# EasyEDA Pro project ProPrj_电池电量显示与开关_2025-10-14.epro

# Schematic Schematic1

## Sheets
1 P1: Board Name: Board1; Create Date: 2025-09-26; Page Name: P1; Project Name: 电池电量显示与开关; Schematic Name: Schematic1; Update Date: 2025-10-06; Company: 嘉立创EDA; Page Size: A4; Version: V1.0
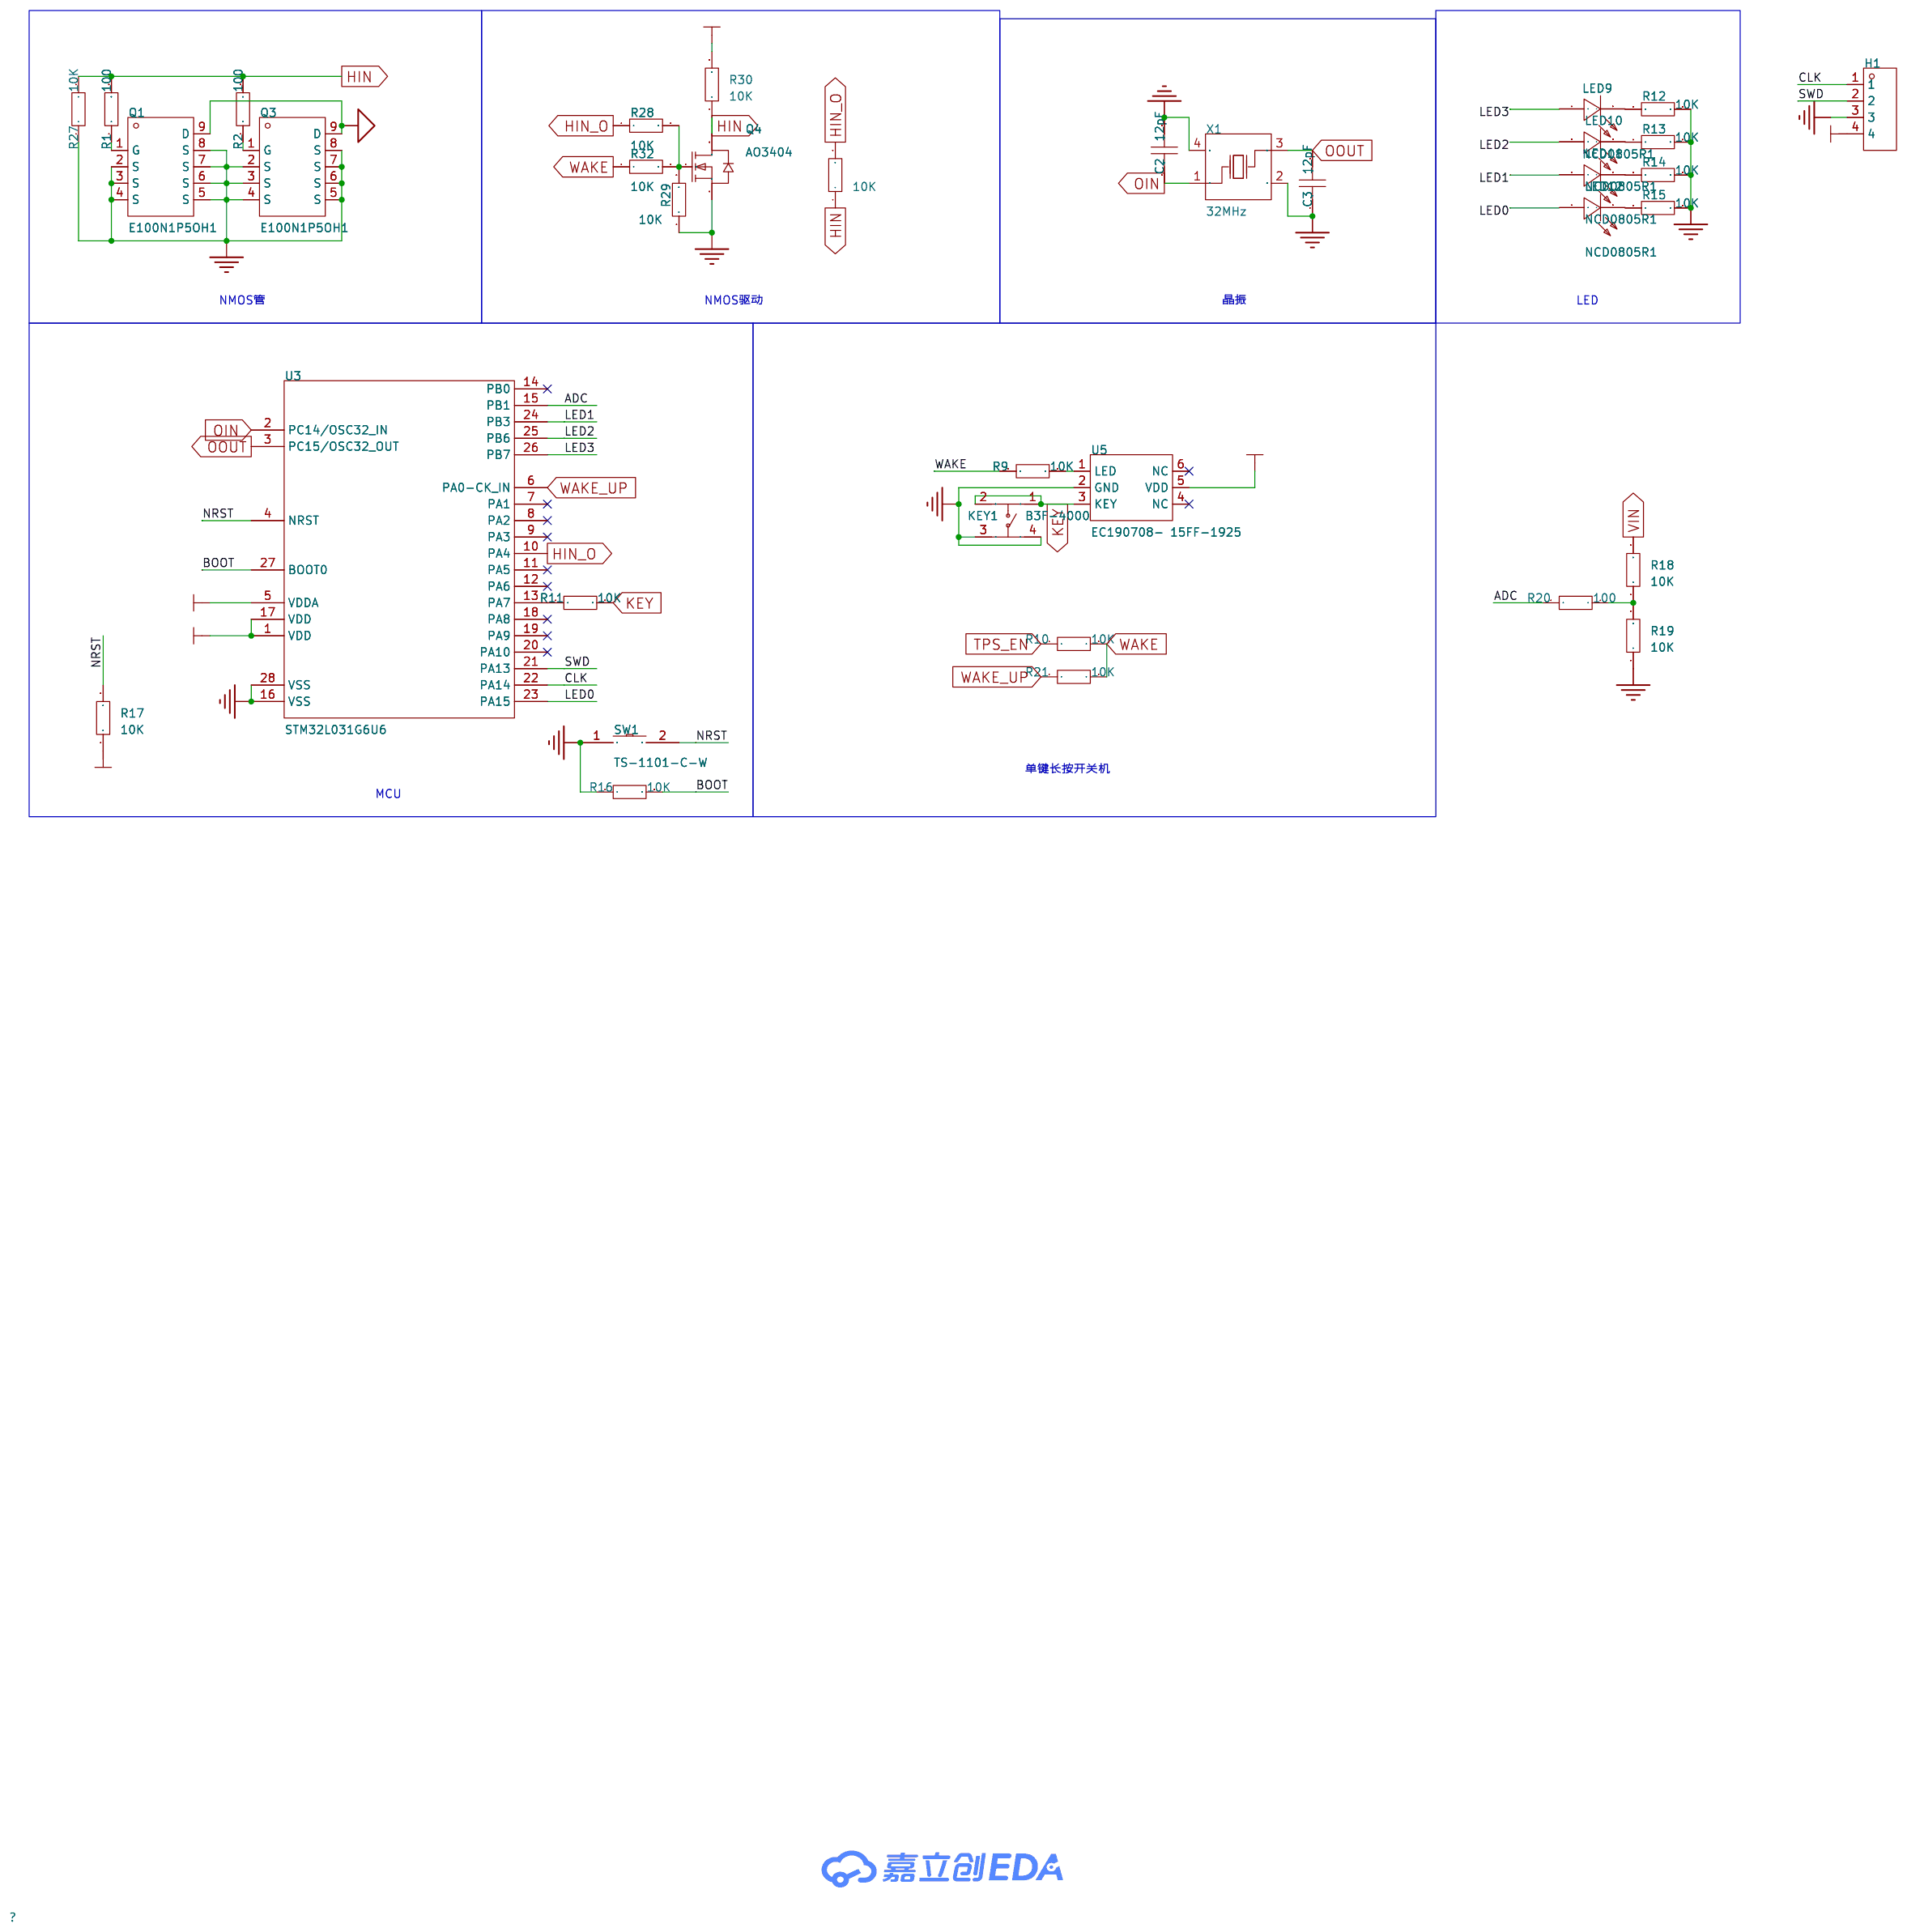
[diagram p0: P1]
2 PWOER: Page Name: PWOER
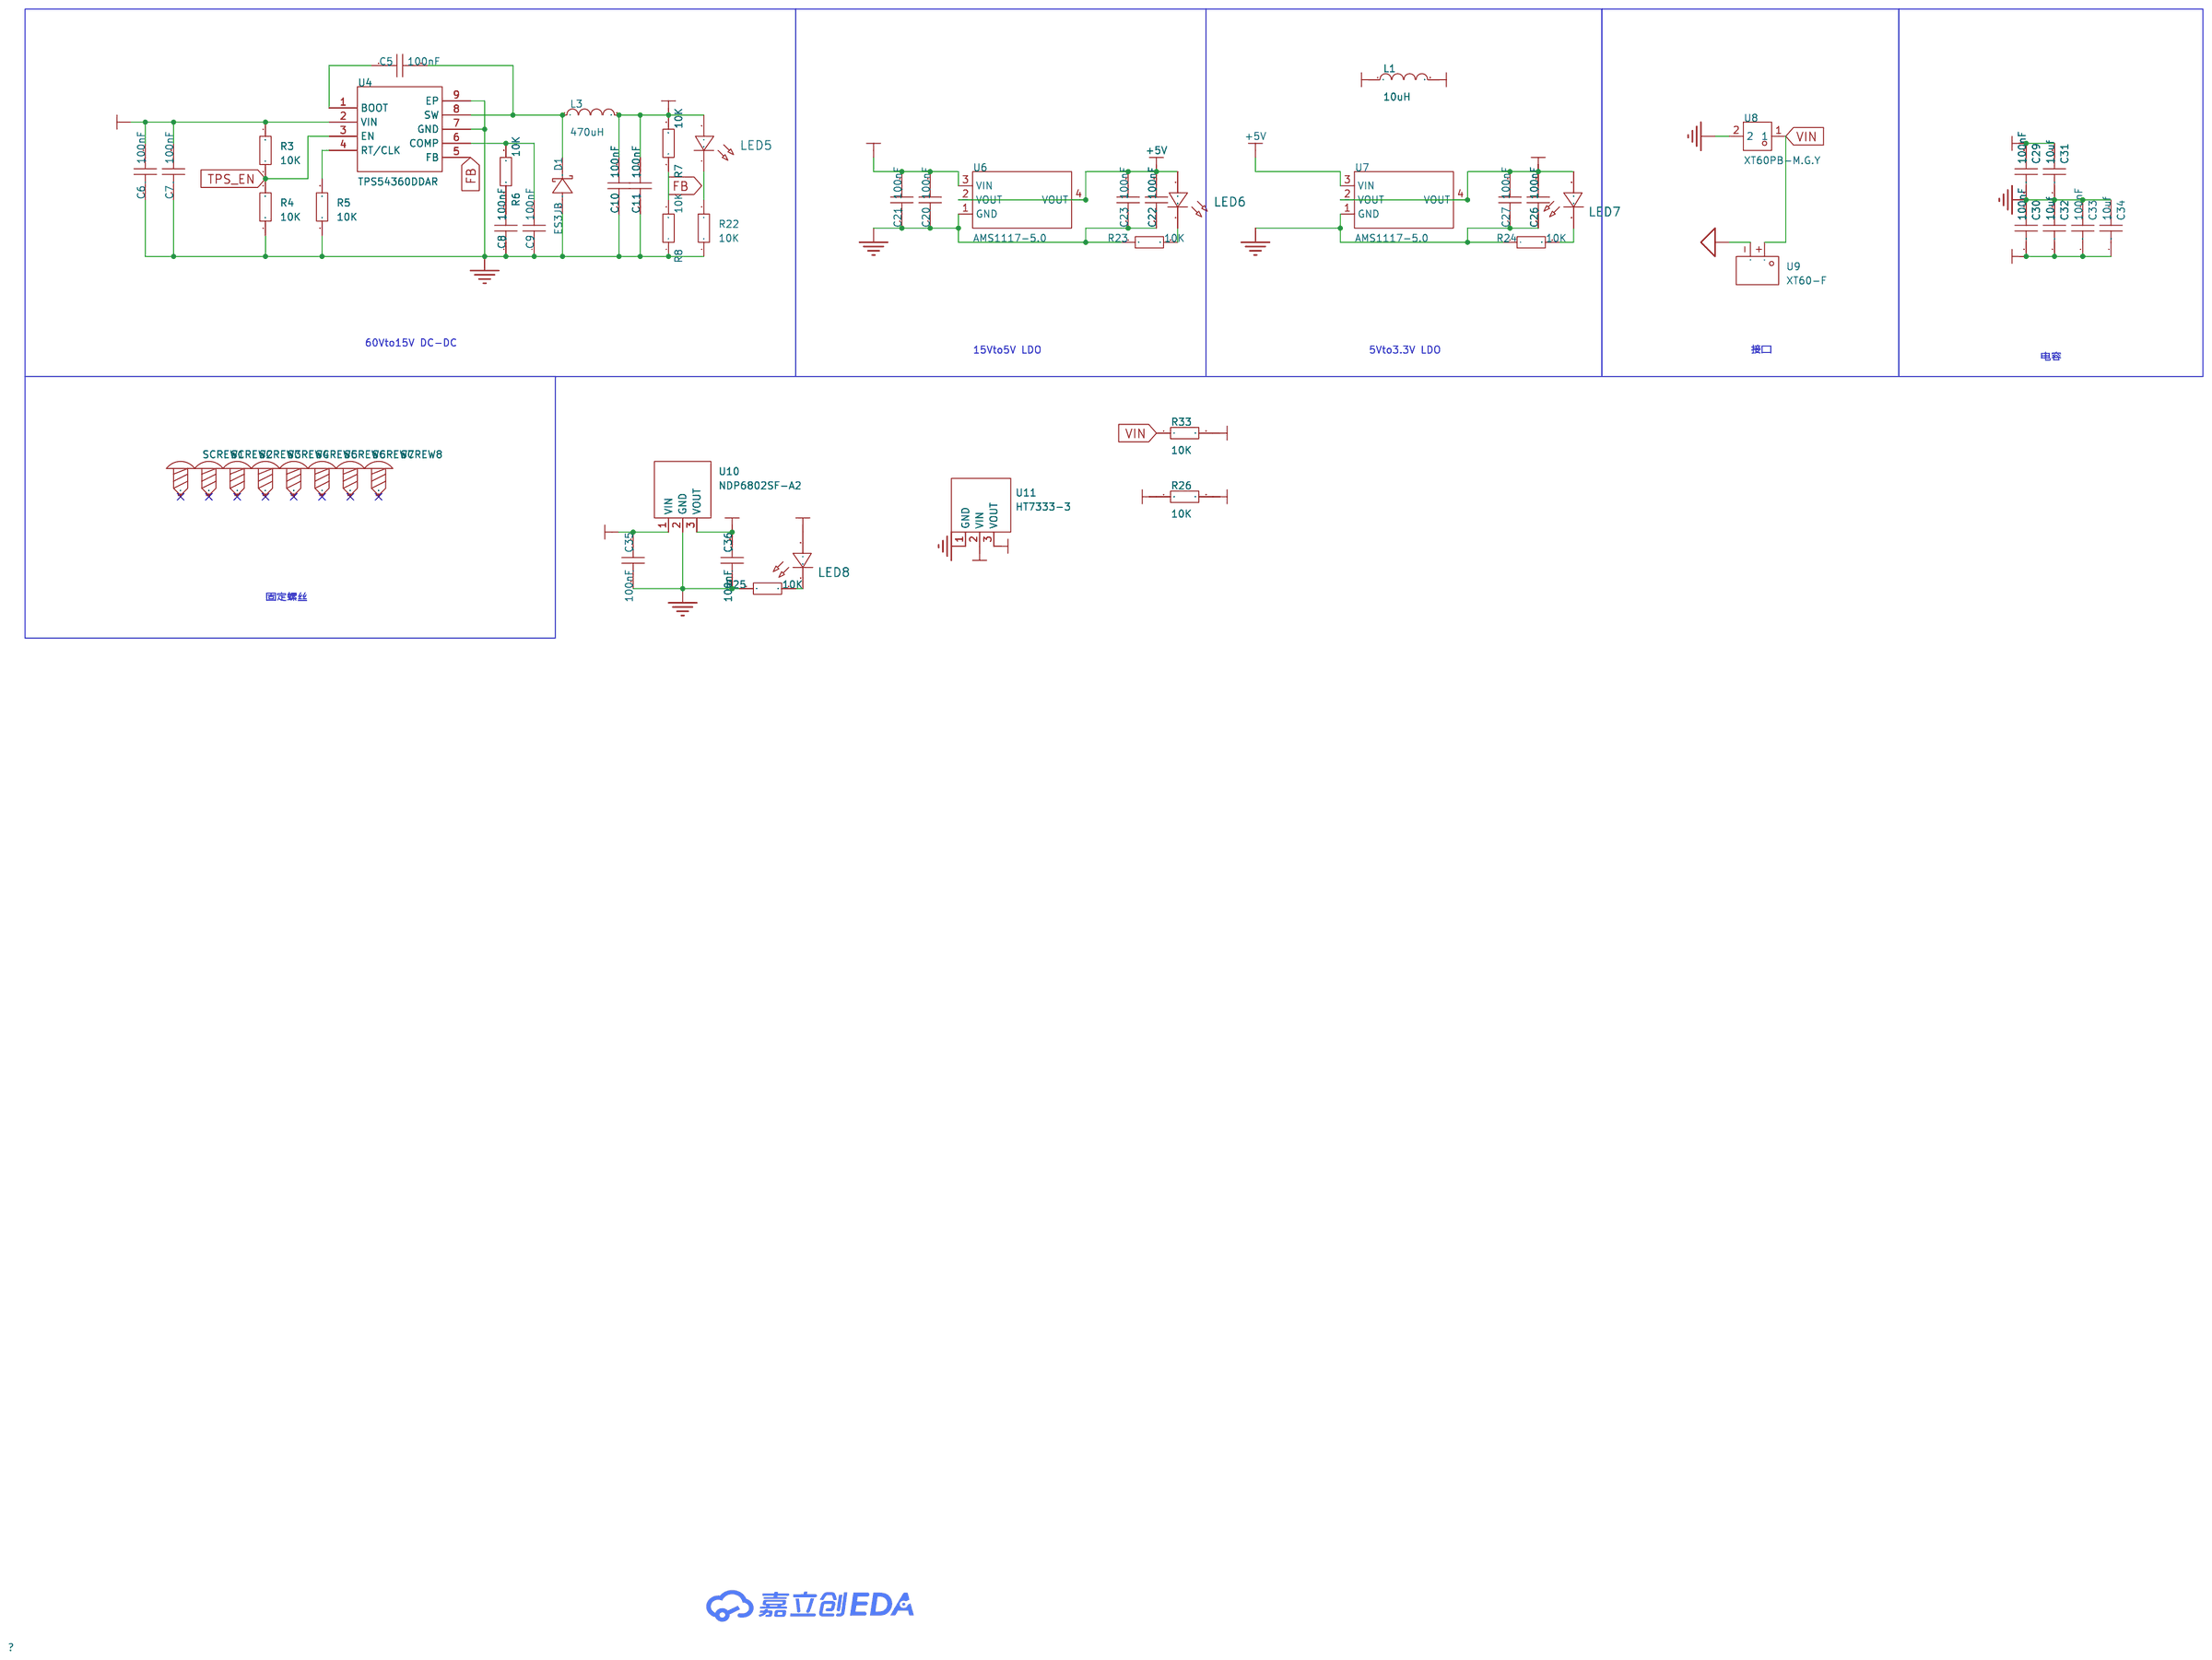
[diagram p1: PWOER]

## Parts
sheet P1
C2  12pF  [C0603]
C3  12pF  [C0603]
H1  -  [HDR-TH_4P-P2.54-V-F]
KEY1  B3F-4000  [KEY-TH_4P-L12.0-W12.0-P5.00-LS13.4-EH]
LED9  NCD0805R1  [LED0805-R-RD]
LED10  NCD0805R1  [LED0805-R-RD]
LED11  NCD0805R1  [LED0805-R-RD]
LED12  NCD0805R1  [LED0805-R-RD]
Q1  E100N1P5OH1  [TOLL-8_L10.4-W9.9-P1.20-LS11.7-BL]
Q3  E100N1P5OH1  [TOLL-8_L10.4-W9.9-P1.20-LS11.7-BL]
Q4  AO3404  [SOT-23-3_L2.9-W1.3-P1.90-LS2.4-BR]
R1  100  [R0603]
R2  100  [R0603]
R9  10K  [R0805]
R10  10K  [R0805]
R11  10K  [R0805]
R12  10K  [R0603]
R13  10K  [R0603]
R14  10K  [R0603]
R15  10K  [R0603]
R16  10K  [R0805]
R17  10K  [R0805]
R18  10K  [R0805]
R19  10K  [R0805]
R20  100  [R0805]
R21  10K  [R0805]
R27  10K  [R0603]
R28  10K  [R0603]
R29  10K  [R0603]
R30  10K  [R0603]
R31  10K  [R0603]
R32  10K  [R0603]
SW1  TS-1101-C-W  [SW-SMD_L6.0-W3.3-LS8.0]
U3  STM32L031G6U6  [UFQFPN-28_L4.0-W4.0-P0.50-BL]
U5  EC190708- 15FF-1925  [SOT-23-6_L2.9-W1.6-P0.95-LS2.9-BL]
X1  32MHz  [CRYSTAL-SMD_4P-L3.2-W2.5-BL]
sheet PWOER
C5  100nF  [C0805]
C6  100nF  [C1206]
C7  100nF  [C1206]
C8  100nF  [C0805]
C9  100nF  [C0805]
C10  100nF  [C1206]
C11  100nF  [C1206]
C20  100nF  [C0805]
C21  100nF  [C0805]
C22  100nF  [C0805]
C23  100nF  [C0805]
C26  100nF  [C0805]
C27  100nF  [C0805]
C29  100nF  [C0603]
C30  100nF  [C0603]
C31  10uf  [C0603]
C32  10uf  [C0603]
C33  100nF  [C0603]
C34  10uf  [C0603]
C35  100nF  [C1206]
C36  100nF  [C0603]
D1  ES3JB  [SMB_L4.6-W3.6-LS5.3-RD]
L1  10uH  [L0805]
L3  470uH  [IND-SMD_L10.4-W10.3]
LED5  -  [LED_0603]
LED6  -  [LED_0603]
LED7  -  [LED_0603]
LED8  -  [LED_0603]
R3  10K  [R0805]
R4  10K  [R0805]
R5  10K  [R0805]
R6  10K  [R0805]
R7  10K  [R0805]
R8  10K  [R0805]
R22  10K  [R0603]
R23  10K  [R0603]
R24  10K  [R0603]
R25  10K  [R0603]
R26  10K  [R0805]
R33  10K  [R0805]
SCREW1  -  [M3螺丝]
SCREW2  -  [M3螺丝]
SCREW3  -  [M3螺丝]
SCREW4  -  [M3螺丝]
SCREW5  -  [M3螺丝]
SCREW6  -  [M3螺丝]
SCREW7  -  [M3螺丝]
SCREW8  -  [M3螺丝]
U4  TPS54360DDAR  [SOIC-8_L5.0-W4.0-P1.27-LS6.0-BL-EP2.0]
U6  AMS1117-5.0  [SOT-223_L6.5-W3.5-P2.30-LS7.0-BR]
U7  AMS1117-5.0  [SOT-223_L6.5-W3.5-P2.30-LS7.0-BR]
U8  XT60PB-M.G.Y  [CONN-TH_XT60PB-M]
U9  XT60-F  [CONN-TH_XT60PB-F]
U10  NDP6802SF-A2  [SOT-89-3_L4.5-W2.4-P1.50-LS4.0-BR]
U11  HT7333-3  [SOT-89-3_L4.5-W2.5-P1.50-LS4.2-BR]

## Library data of the parts
C2 C3 C29-C34 C36 = CAP_0603: Supplier Footprint: 0603
H1 = HDR-F_2.54_1x4P: Supplier Part: C2718488; Supplier Footprint: 插件
KEY1 = B3F-4000: 电路结构:单刀单掷;按钮形状:圆形按钮;安装方式:直插;开关长度:12mm;开关宽度:12mm;开关高度:4.3mm;触点电流:50mA;额定电压(DC):24V;带灯:-;机械寿命:-;; LCSC Part Name: 12*12*4.3mm 直插 轻触开关; Supplier Part: C87494; Manufacturer: OMRON(欧姆龙); Supplier Footprint: 插件; JLCPCB Part Class: 扩展库; Supplier: LCSC; Circuit: 单刀单掷; Actuator Style: 圆形按钮; Mounting Style: 直插; Switch Length: 12mm; Switch Width: 12mm; Switch Height: 4.3mm; Contact Current: 50mA; Voltage Rating (DC): 24V
LED9-LED12 = NCD0805R1: 灯头类型:-;发光颜色:红色;正向电压(VF):1.6V~2.6V;功率:65mW;正向电流:20mA;主波长:615nm~630nm;二极管配置:独立二极管;透镜颜色:无色透明透镜;色温:-;发光强度:67mcd~195mcd;发光角度:130°;载带方式:-;工作温度:-30℃~+85℃;; Supplier Part: C84256; Manufacturer: 国星光电; Supplier Footprint: 0805; JLCPCB Part Class: 基础库; Datasheet: https://atta.szlcsc.com/upload/public/pdf/source/20200820/C84256_F0A75A43B3EAD75808600A0514C76B99.pdf; Supplier: LCSC; Emitted Color: 红色; Forward Voltage (VF): 1.6V~2.6V; Power Dissipation: 65mW; Forward Current: 20mA; Dominant Wavelength: 615nm~630nm; Diode Configuration: 独立二极管; Lens Color: 无色透明透镜; Luminous Intensity: 67mcd~195mcd; Viewing Angle: 130°; Operating Temperature: -30℃~+85℃
Q1 Q3 = E100N1P5OH1: 数量:1个N沟道;漏源电压(Vdss):100V;连续漏极电流(Id):330A;导通电阻(RDS(on)):1.5mΩ@10V;耗散功率(Pd):430W;阈值电压(Vgs(th)):3.8V@250uA;; LCSC Part Name: N沟道,电流:330A,耐压:100V; Supplier Part: C29781174; Manufacturer: Existar(毅芯达); Supplier Footprint: TOLL-8; JLCPCB Part Class: 扩展库; Datasheet: https://item.szlcsc.com/datasheet/E100N1P5OH1/31514294.html; Supplier: LCSC; Number: 1个N沟道; Drain to Source Voltage: 100V; Current - Continuous Drain(Id): 330A; RDS(on): 1.5mΩ@10V; Pd - Power Dissipation: 430W; Gate Threshold Voltage (Vgs(th)): 3.8V@250uA; Gate Charge(Qg): 362nC@10V; Input Capacitance(Ciss): 21.91nF; Reverse Transfer Capacitance (Crss@Vds): 90pF; Operating Temperature: -55℃~+150℃; Type: N沟道; Output Capacitance(Coss): 2.94nF
Q4 = AO3404_C192925: 数量:1个N沟道;漏源电压(Vdss):30V;连续漏极电流(Id):5A;导通电阻(RDS(on)):31mΩ@10V;耗散功率(Pd):1.4W;阈值电压(Vgs(th)):2.4V@250uA;; LCSC Part Name: 1个N沟道 耐压:30V 电流:5A; Supplier Part: C192925; Manufacturer: Hottech(合科泰); Supplier Footprint: SOT-23; JLCPCB Part Class: 扩展库; Datasheet: https://item.szlcsc.com/datasheet/AO3404/225895.html; Supplier: LCSC; Number: 1个N沟道; Drain to Source Voltage: 30V; Current - Continuous Drain(Id): 5A; RDS(on): 31mΩ@10V; Pd - Power Dissipation: 1.4W; Gate Threshold Voltage (Vgs(th)): 2.4V@250uA; Gate Charge(Qg): 6.3nC@10V; Input Capacitance(Ciss): 310pF; Reverse Transfer Capacitance (Crss@Vds): 50pF; Type: N沟道; Output Capacitance(Coss): 45pF
R1 R2 R12-R15 R22-R25 R27-R32 = Res_0603: Supplier Footprint: 0603
R3-R11 R16-R21 R26 R33 = Res_0805: Supplier Footprint: 0805
SW1 = TS-1101-C-W: 电路结构:单刀单掷;按钮形状:矩形按钮;作用力:260gf;安装方式:立贴;开关长度:6mm;开关宽度:3.6mm;开关高度:2.5mm;带支架:不带;触点电流:50mA;额定电压(AC):-;额定电压(DC):12V;额定功率:-;绝缘电阻:-;带灯:无;机械寿命:5万次;; LCSC Part Name: 6*3.6*2.5mm 立贴 轻触开关; Supplier Part: C318938; Manufacturer: XKB Connectivity(中国星坤); Supplier Footprint: SMD; JLCPCB Part Class: 扩展库; Datasheet: https://atta.szlcsc.com/upload/public/pdf/source/20200227/C318938_C2E53B1EEDE37D980A33616AC086DE53.pdf; Supplier: LCSC; Circuit: 单刀单掷; Actuator Style: 矩形按钮; Operating Force: 260gf; Mounting Style: 立贴; Switch Length: 6mm; Switch Width: 3.6mm; Switch Height: 2.5mm; Strike Gundam: 不带; Contact Current: 50mA; Voltage Rating (DC): 12V; Actuator/Cap Color: 白色带淡绿; With Lamp: 无; Mechanical Life: 5万次; Operating Temperature: -30℃~+85℃
U3 = STM32L031G6U6: CPU内核:ARM-M系列;应用领域:-;; LCSC Part Name: 超低功耗Arm Cortex-M0+ MCU，具有32-KB Flash存储器和32 MHz CPU; Supplier Part: C96514; Manufacturer: ST(意法半导体); Supplier Footprint: UFQFPN-28(4x4); JLCPCB Part Class: 扩展库; Datasheet: https://item.szlcsc.com/datasheet/STM32L031G6U6/97719.html; Supplier: LCSC; CPU Core: ARM-M系列; Program Storage Size: 32KB; Program Memory Type: FLASH
U5 = EC190708- 15FF-1925: Supplier Part: C9900095406; Supplier Footprint: SOT23-6; JLCPCB Part Class: Extended Part; Supplier: LCSC
X1 = X322532MOB4SI: 晶振类型:贴片晶振;频率:32MHz;常温频差:±10ppm;负载电容:12pF;频率稳定度:±20ppm;; LCSC Part Name: YSX321SL 32MHZ 4P 3225 12PF ±10PPM -40~85℃ (±20PPM); Supplier Part: C9009; Manufacturer: YXC(扬兴晶振); Supplier Footprint: SMD3225-4P; JLCPCB Part Class: 扩展库; Datasheet: https://item.szlcsc.com/datasheet/X322532MOB4SI/9529.html; Supplier: LCSC; Type: 贴片晶振; Normal temperature Frequency Tolerance: ±10ppm; Load Capacitance: 12pF; Frequency Stability: ±20ppm; Operating Temperature: -40℃~+85℃
C5 C8 C9 C20-C23 C26 C27 = CAP_0805: Supplier Footprint: 0805
C6 C7 C10 C11 C35 = CAP_1206: Supplier Footprint: 1206
D1 = ES3JB_C18199163: 二极管配置:独立式;正向压降(Vf):1.7V@3A;直流反向耐压(Vr):600V;整流电流:3A;反向恢复时间(Trr):35ns;; LCSC Part Name: 耐压:600V 电流:3A 反向恢复时间：35ns; Supplier Part: C18199163; Manufacturer: R+O(宏嘉诚); Supplier Footprint: SMB; JLCPCB Part Class: 扩展库; Datasheet: https://item.szlcsc.com/datasheet/ES3JB/19354395.html; Supplier: LCSC; Diode Configuration: 独立式; Voltage - Forward(Vf@If): 1.7V@3A; Voltage - DC Reverse(Vr): 600V; Current - Rectified: 3A; Reverse Leakage Current (Ir): 2uA@600V; Reverse Recovery Time (trr): 35ns; Operating Junction Temperature Range: -55℃~+150℃; Non-Repetitive Peak Forward Surge Current: 100A
L1 = MGFL2012F100MT-LF: 电感值:10uH;精度:±20%;额定电流:500mA;饱和电流(Isat):-;直流电阻(DCR):320mΩ;; LCSC Part Name: 10uH ±20%; Supplier Part: C281113; Manufacturer: microgate(麦捷科技); Supplier Footprint: 0805; JLCPCB Part Class: 扩展库; Datasheet: https://atta.szlcsc.com/upload/public/pdf/source/20181025/C281113_18633E3AF8F2E9832A865B8532475DE8.pdf; Supplier: LCSC; Tolerance: ±20%; Rated Current: 500mA; DC Resistance (DCR): 320mΩ
L3 = SMDRH104R-471MT: 电感值:470uH;精度:±20%;额定电流:-;饱和电流(Isat):650mA;类型:磁胶屏蔽电感;; LCSC Part Name: 470uH ±20% 650mA; Supplier Part: C10147; Manufacturer: SXN(顺翔诺); Supplier Footprint: SMD,10.4x10.3mm; JLCPCB Part Class: 扩展库; Datasheet: https://atta.szlcsc.com/upload/public/pdf/source/20210810/F0A33CD6E7727942765DE065EF8A985E.pdf; Supplier: LCSC; Tolerance: ±20%; Current - Saturation(Isat): 650mA; DC Resistance(DCR): 1.476Ω; Type: 磁胶屏蔽电感
LED5-LED8 = LED_0603-R: Supplier Footprint: 0603
SCREW1-SCREW8 = M3螺丝: Supplier Footprint: 插件
U4 = TPS54360DDAR: 功能类型:降压型;输出类型:可调;工作电压:4.5V~60V;输出电压:800mV~58.8V;输出电流:3.5A;; LCSC Part Name: 60V输入、3.5A输出降压DC-DC转换器; Supplier Part: C44377; Manufacturer: TI(德州仪器); Supplier Footprint: SOIC-8-EP; JLCPCB Part Class: 扩展库; Datasheet: https://www.ti.com/cn/lit/gpn/tps54360; Supplier: LCSC; Function: 降压型; Output Type: 可调; Input Voltage: 4.5V~60V; Output Voltage: 800mV~58.8V; Output Current: 3.5A; Switching Frequency: 2.5MHz; Operating Temperature: -40℃~+150℃@(TJ); Synchronous Rectification: 否; Number of Outputs: 1; Topology: 降压式; Switch tube (built-in/external): 内置
U6 U7 = AMS1117-5.0_C6187: 输出类型:固定;工作电压:15V;输出电压:5V;输出电流:1A;电源纹波抑制比(PSRR):60dB;输出极性:正极;; LCSC Part Name: 输入15V 输出5V 1A; Supplier Part: C6187; Manufacturer: AMS; Supplier Footprint: SOT-223; JLCPCB Part Class: Basic Part; Datasheet: https://item.szlcsc.com/datasheet/AMS1117-5.0/6653.html; Supplier: LCSC; Output Type: 固定; Voltage - Supply: 15V; Output Voltage: 5V; Output Current: 1A; Power Supply Rejection Ratio (PSRR): 60dB; Voltage Dropout: 1.3V; Operating Temperature: -40℃~+125℃; Output Configuration: 正极; Number of Outputs: 1
U8 = XT60PB-M.G.Y: LCSC Part Name: XT60PB 20A双芯PCB直插公金黄; Supplier Part: C19268037; Manufacturer: AMASS(艾迈斯); JLCPCB Part Class: 扩展库; Datasheet: https://item.szlcsc.com/datasheet/XT60PB-M.G.Y/20526048.html; Supplier: LCSC
U9 = XT60-F: 类别:-;类型1:-;; LCSC Part Name: AMASS(艾迈斯)XT60模型插头 3.5mm镀金香蕉头母头 XT60-F; Supplier Part: C98734; Manufacturer: AMASS(艾迈斯); JLCPCB Part Class: 扩展库; Datasheet: https://item.szlcsc.com/datasheet/XT60-F/99944.html; Supplier: LCSC; Type: 香蕉头; Colour: 黄色; InterfaceType: 母头; MetalMaterial: 镀金
U10 = NDP6802SF-A2: 输出类型:固定;工作电压:72V;输出电压:12V;输出电流:100mA;电源纹波抑制比(PSRR):60dB@(100Hz);输出极性:正极;; LCSC Part Name: 输入电压85V、100mA，超高压线性稳压器; Supplier Part: C20415513; Manufacturer: NDP(芯潭微); Supplier Footprint: SOT-89-3L; JLCPCB Part Class: 扩展库; Datasheet: https://item.szlcsc.com/datasheet/NDP6802SF-A2/21741153.html; Supplier: LCSC; Output Type: 固定; Voltage - Supply: 72V; Output Voltage: 12V; Output Current: 100mA; Power Supply Rejection Ratio (PSRR): 60dB@(100Hz); Voltage Dropout: 300mV@(50mA); standby current: 3uA; Features: 带使能；过流保护；过热保护; Operating Temperature: -40℃~+150℃@(Tj); Output Configuration: 正极; Number of Outputs: 1
U11 = HT7333-3: 输出类型:固定;工作电压:30V;输出电压:3.3V;输出电流:250mA;电源纹波抑制比(PSRR):-;输出极性:正极;; LCSC Part Name: 输入30V 输出3.3V 250mA; Supplier Part: C84207; Manufacturer: HOLTEK(合泰/盛群); Supplier Footprint: SOT-89-3; JLCPCB Part Class: 扩展库; Datasheet: https://www.holtek.com.cn/webapi/116706/simHT73xx-3v120.pdf; Supplier: LCSC; Output Type: 固定; Voltage - Supply: 30V; Output Voltage: 3.3V; Output Current: 250mA; Voltage Dropout: 300mV@(30mA); standby current: 1uA; Features: 软启动；过流保护; Operating Temperature: -40℃~+85℃; Output Configuration: 正极; Number of Outputs: 1

## Nets
3V3: C26.2 C27.2 C30.1 C32.1 C33.1 C34.1 H1.4 L1.2 LED7.2(A) R17.1 R26.2 U3.1(VDD) U3.17(VDD) U7.2(VOUT) U7.4(VOUT)
3V3A: C29.2 C31.2 L1.1 U3.5(VDDA)
3V32: LED8.2(A) R26.1 U5.5(VDD) U11.3(VOUT)
12V: C36.2 U10.3(VOUT) U11.2(VIN)
+5V: C22.2 C23.2 LED6.2(A) U6.2(VOUT) U6.4(VOUT) U7.3(VIN)
+15V: C10.2 C11.2 C20.2 C21.2 L3.2 LED5.2(A) R7.2 R30.2 U6.3(VIN)
AGND: Q1.9(D) Q3.9(D) U9.-(2)
GND: C2.2 C3.1 C6.1 C7.1 C8.1 C9.1 C10.1 C11.1 C20.1 C21.1 C22.1 C23.1 C26.1 C27.1 C29.1 C30.2 C31.1 C32.2 C33.2 C34.2 C35.2 C36.1 D1.2(A) H1.3 KEY1.3 KEY1.4 Q1.2(S) Q1.3(S) Q1.4(S) Q1.5(S) Q1.6(S) Q1.7(S) Q1.8(S) Q3.2(S) Q3.3(S) Q3.4(S) Q3.5(S) Q3.6(S) Q3.7(S) Q3.8(S) Q4.2(S) R4.1 R5.1 R8.1 R12.2 R13.2 R14.2 R15.2 R16.1 R19.1 R22.1 R23.1 R24.1 R25.1 R27.1 R29.1 SW1.1 U3.16(VSS) U3.28(VSS) U4.7(GND) U4.9(EP) U5.2(GND) U6.1(GND) U7.1(GND) U8.2 U10.2(GND) U11.1(GND) X1.2(GND) X1.4(GND)
VIN: R18.2 R33.1 U8.1 U9.+(1)
VIN_1: C6.2 C7.2 C35.1 R3.2 R33.2 U4.2(VIN) U10.1(VIN)
ADC: R20.2 U3.15(PB1)
BOOT: R16.2 U3.27(BOOT0)
CLK: H1.1 U3.22(PA14)
FB: R7.1 R8.2 U4.5(FB)
HIN: Q4.3(D) R1.2 R2.2 R27.2 R30.1 R31.1
HIN_O: R28.1 R31.2 U3.10(PA4)
KEY: KEY1.1 KEY1.2 R11.2 U5.3(KEY)
LED0: U3.23(PA15)
LED1: U3.24(PB3)
LED2: U3.25(PB6)
LED3: U3.26(PB7)
NRST: R17.2 SW1.2 U3.4(NRST)
OIN: C2.1 U3.2(PC14/OSC32_IN) X1.1(OSC1)
OOUT: C3.2 U3.3(PC15/OSC32_OUT) X1.3(OSC2)
SWD: H1.2 U3.21(PA13)
TPS_EN: R3.1 R4.2 R10.1 U4.3(EN)
WAKE: R9.1 R10.2 R21.2 R32.1
WAKE_UP: R21.1 U3.6(PA0-CK_IN)
$1N1231: Q3.1(G) R2.1
$1N1235: Q1.1(G) R1.1
$1N3158: R9.2 U5.1(LED)
$1N3339: R11.1 U3.13(PA7)
$1N5444: R18.1 R19.2 R20.1
$1N9210: Q4.1(G) R28.2 R29.2 R32.2
$2N1364: C5.1 U4.1(BOOT)
$2N1375: C5.2 D1.1(K) L3.1 U4.8(SW)
$2N1674: R5.2 U4.4(RT/CLK)
$2N1730: C9.2 R6.2 U4.6(COMP)
$2N1780: C8.2 R6.1
$2N8883: LED5.1(C) R22.2
$2N8964: LED6.1(C) R23.2
$2N9032: LED7.1(C) R24.2
$2N9110: LED8.1(C) R25.2

Not connected (* = marked no-connect by the designer): LED9 1(+) 2(-); LED10 1(+) 2(-); LED11 1(+) 2(-); LED12 1(+) 2(-); R12 1; R13 1; R14 1; R15 1; SCREW1 1*; SCREW2 1*; SCREW3 1*; SCREW4 1*; SCREW5 1*; SCREW6 1*; SCREW7 1*; SCREW8 1*; U3 7(PA1)* 8(PA2)* 9(PA3)* 11(PA5)* 12(PA6)* 14(PB0)* 18(PA8)* 19(PA9)* 20(PA10)*; U5 4(NC)* 6(NC)*

## Notes on the sheets
sheet 1
- NMOS管
- NMOS驱动
- 晶振
- LED
- 单键长按开关机
- MCU
sheet 2
- 60Vto15V DC-DC
- 15Vto5V LDO
- 5Vto3.3V LDO
- 接口
- 电容
- 固定螺丝

# Board PCB1
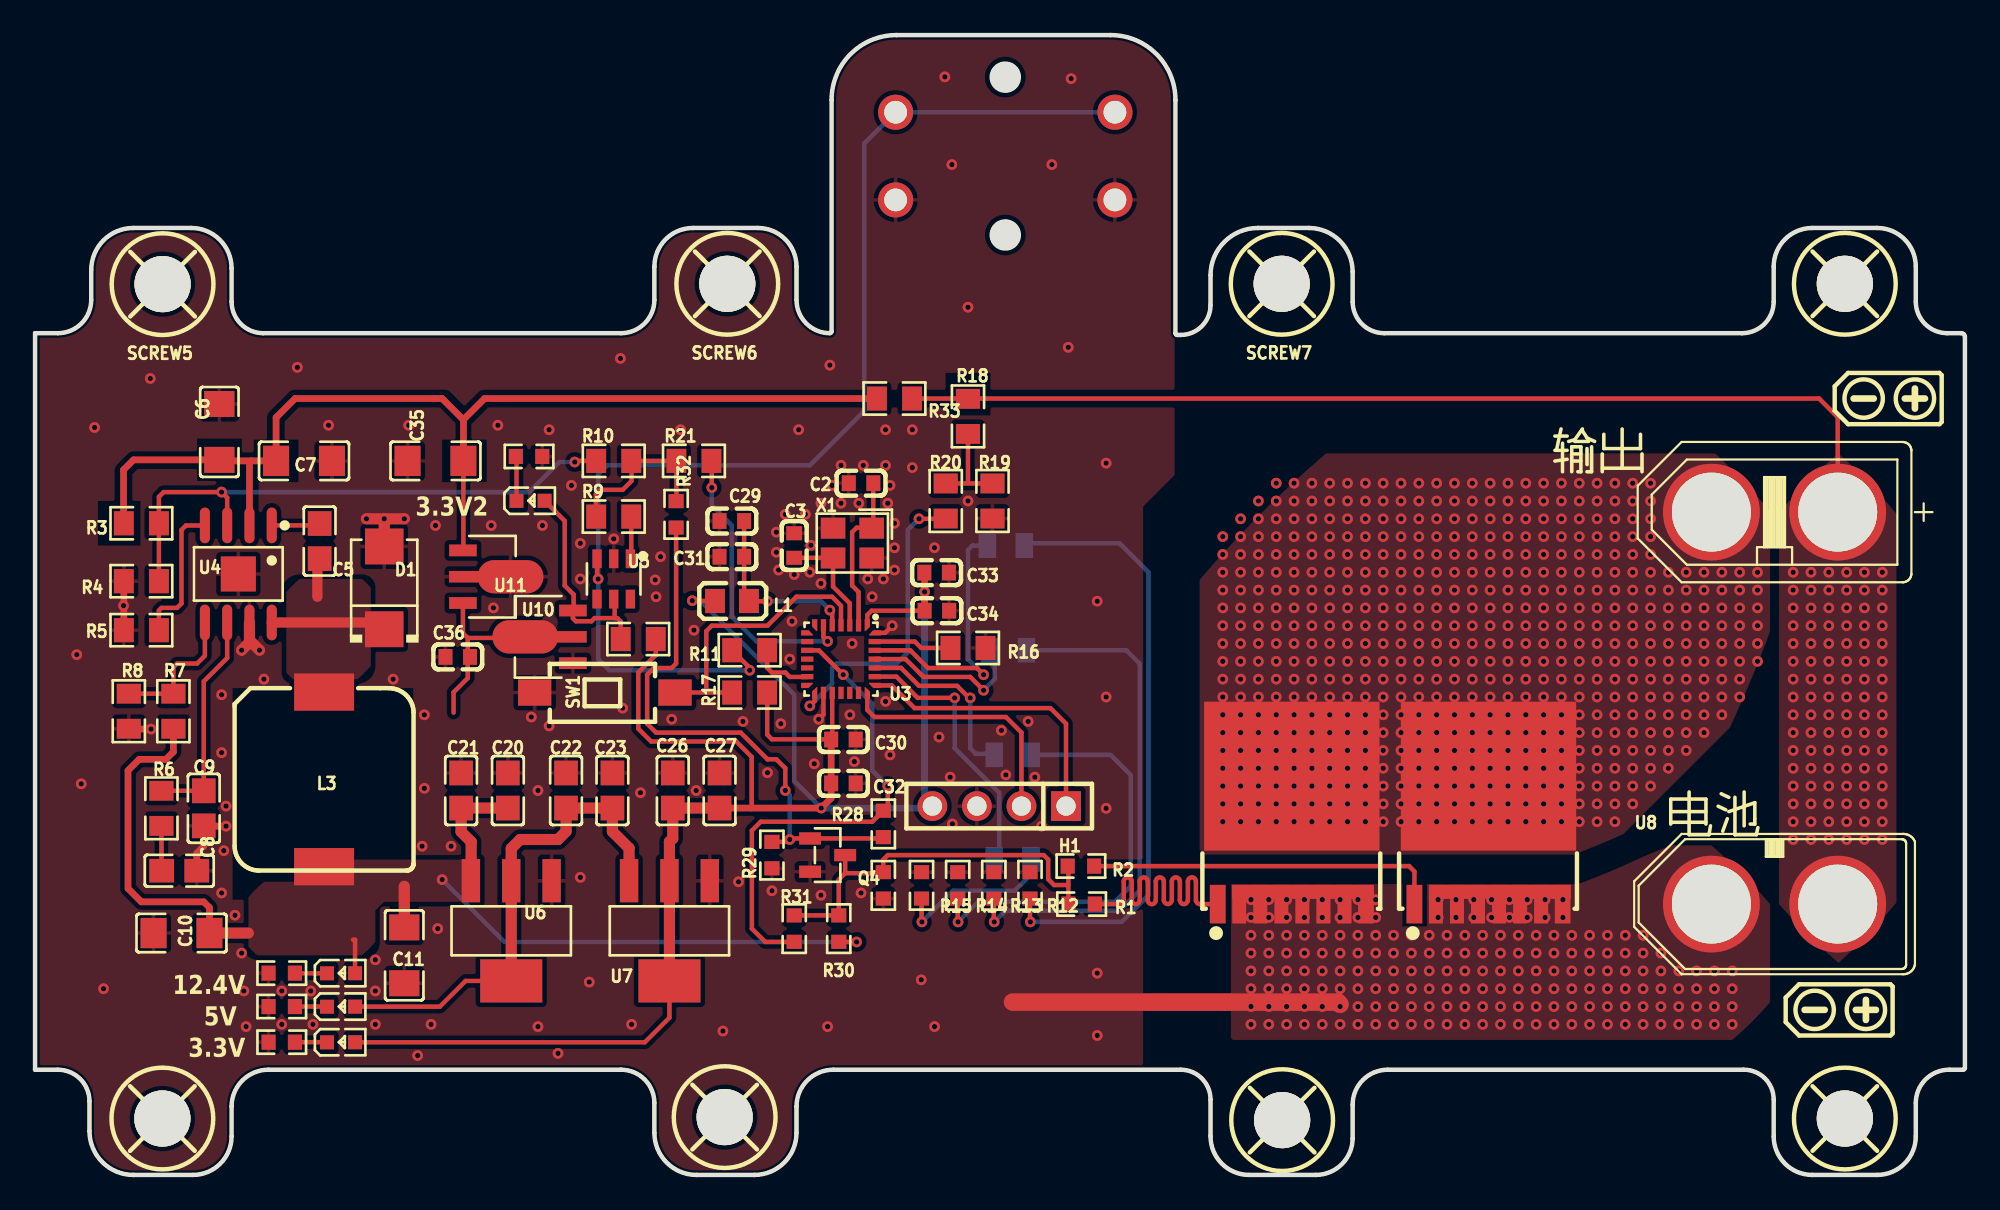
[diagram p2: board, top side]
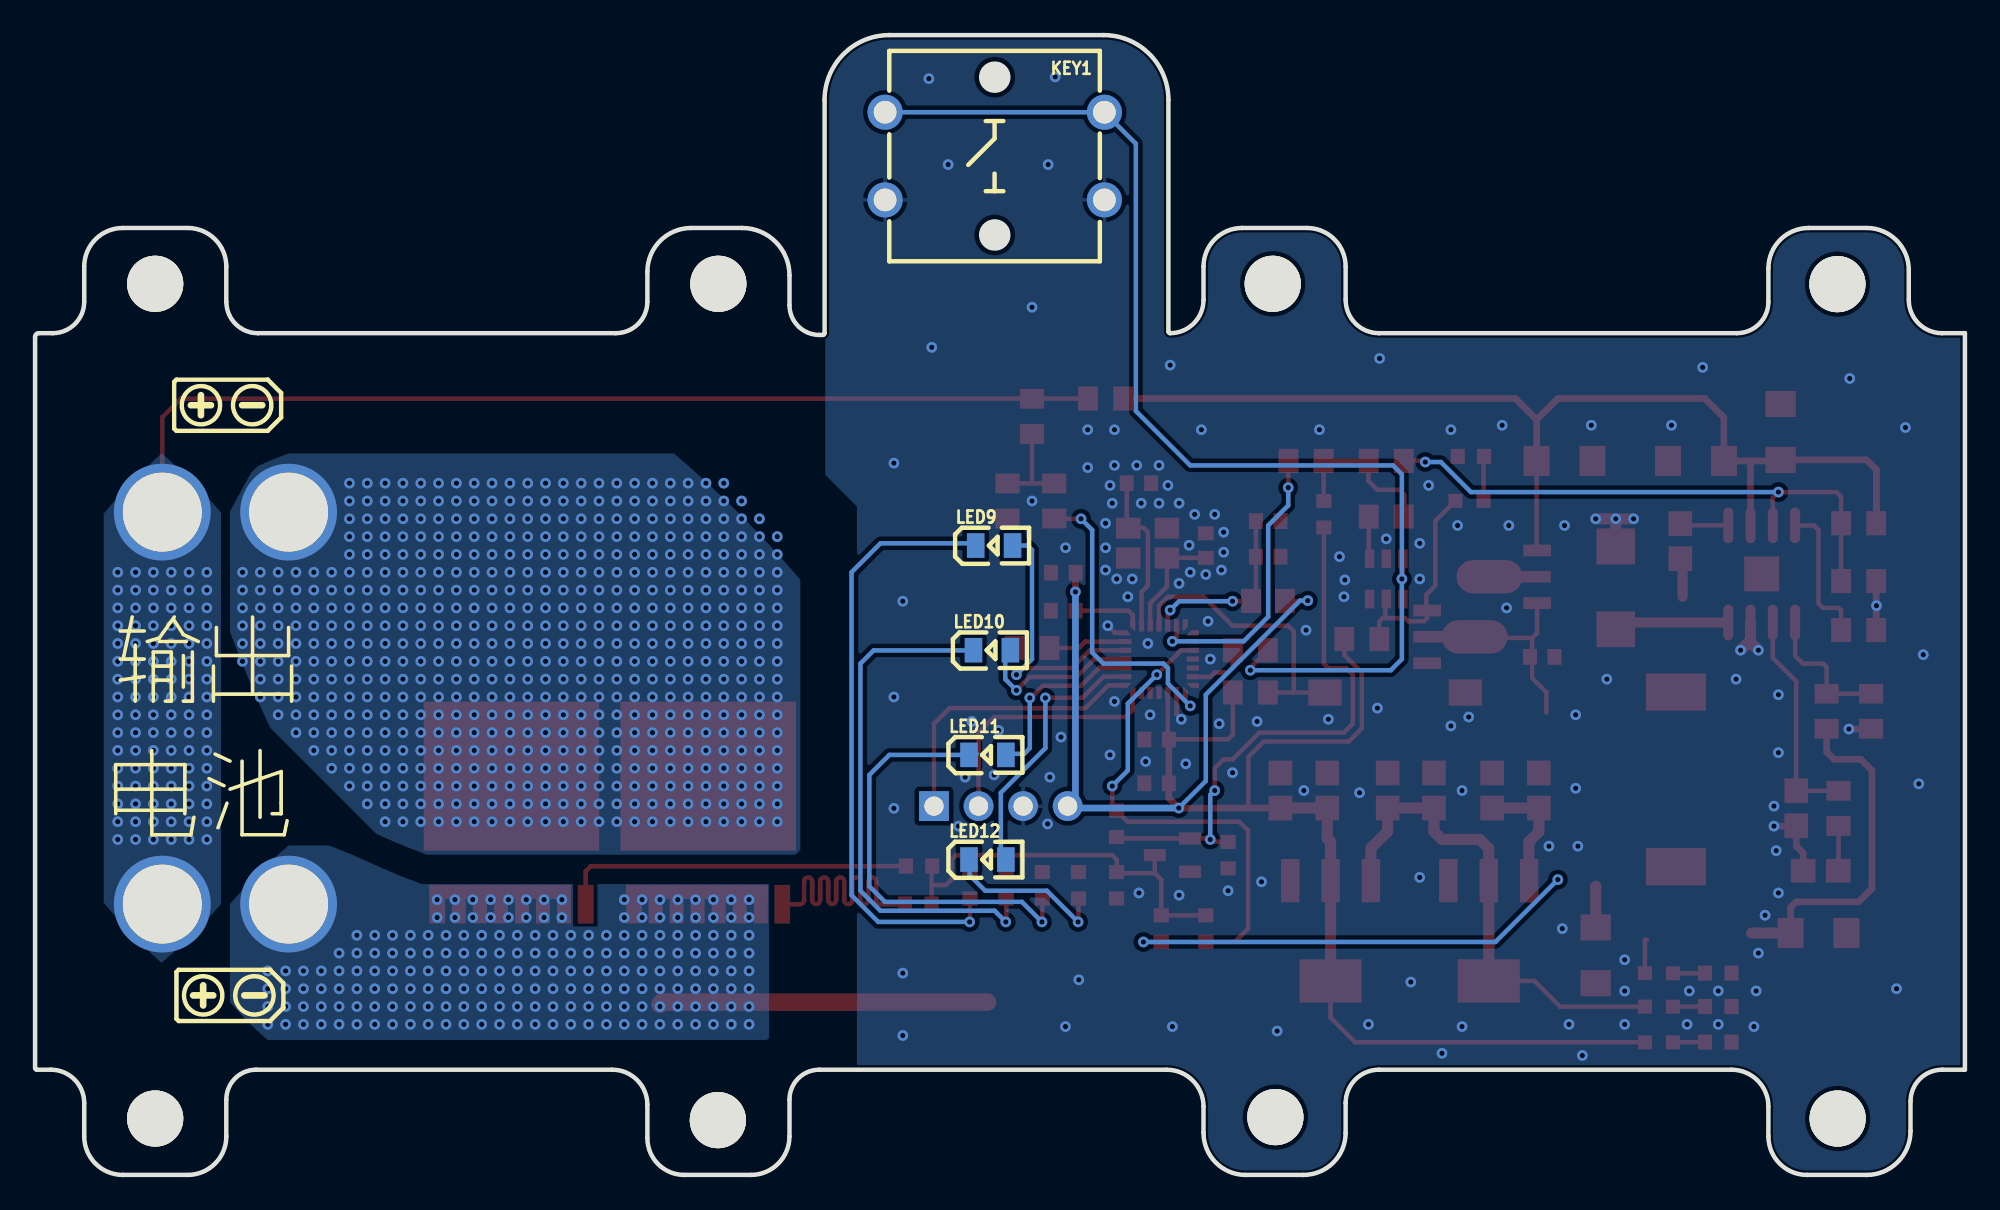
[diagram p3: board, bottom side, seen from below]

Outline 110 x 65 mm; copper layers: Top Layer, Bottom Layer. Coordinates in mm from the lower left corner of the outline.
Outline path: 0,48 1.3,48 arc(2.64,48.56) 3.2,49.9 3.2,51.6 arc(3.9,53.3) 5.6,54 8.9,54 arc(10.53,53.33) 11.2,51.7 11.2,49.8 arc(11.73,48.53) 13,48 33.4,48 arc(34.74,48.56) 35.3,49.9 35.3,51.8 arc(35.94,53.36) 37.5,54 41.2,54 arc(42.76,53.36) 43.4,51.8 43.4,49.9 arc(43.96,48.56) 45.3,48 arc(45.37,48.03) 45.4,48.1 45.4,61.3 arc(46.48,63.92) 49.1,65 61.3,65 arc(63.92,63.92) 65,61.3 65,48 arc(65.03,47.93) 65.1,47.9 65.3,47.9 arc(66.5,48.4) 67,49.6 67,51.3 arc(67.79,53.21) 69.7,54 72.6,54 arc(74.37,53.27) 75.1,51.5 75.1,49.8 arc(75.63,48.53) 76.9,48 97.3,48 arc(98.57,48.53) 99.1,49.8 99.1,51.8 arc(99.74,53.36) 101.3,54 105,54 arc(106.56,53.36) 107.2,51.8 107.2,49.8 arc(107.73,48.53) 109,48 109.8,48 arc(109.94,47.94) 110,47.8 110,6.1 arc(109.97,6.03) 109.9,6 109.1,6 arc(107.76,5.44) 107.2,4.1 107.2,2.2 arc(106.56,0.64) 105,0 101.3,0 arc(99.74,0.64) 99.1,2.2 99.1,4.3 arc(98.6,5.5) 97.4,6 77.1,6 arc(75.69,5.41) 75.1,4 75.1,2.1 arc(74.48,0.62) 73,0 69.2,0 arc(67.64,0.64) 67,2.2 67,4.3 arc(66.5,5.5) 65.3,6 45.5,6 arc(44.02,5.38) 43.4,3.9 43.4,2.4 arc(42.7,0.7) 41,0 37.7,0 arc(36,0.7) 35.3,2.4 35.3,4.1 arc(34.74,5.44) 33.4,6 13.3,6 arc(11.82,5.38) 11.2,3.9 11.2,2.2 arc(10.56,0.64) 9,0 5.6,0 arc(3.83,0.73) 3.1,2.5 3.1,4.2 arc(2.57,5.47) 1.3,6 0,6 0,48
Stack: Top Layer 0.035mm / Dielectric1 1.51mm FR4 er 4.5 / Bottom Layer 0.035mm

## Design rules (mm)
net $1N1235: DP1
net $1N1231: DP1
template: JLCPCB Capability(Two Layers Board)
spacing copperThickness1oz (default): track to track 0.102, other pairs 0.152 to 0.3
spacing copperThickness2oz: track to track 0.203, other pairs 0.152 to 0.3
track width copperThickness1oz (default): min 0.127, default 0.254, max 2.54
track width copperThickness2oz: min 0.203, default 0.254, max 2.54
differential pair differentialPair (default): width min 0.127, default 0.254, max 2.54; gap min 0.152, default 0.152
via viaSize (default): diameter min 0.5, default 0.61, max 10; hole min 0.3, default 0.305, max 6.3

## Placement (name value [footprint] x y rotation side)
C2  12pF  [C0603]  47.08 39.45 180 top
C3  12pF  [C0603]  43.27 35.89 270 top
C5  100nF  [C0805]  16.22 36.14 270 top
C6  100nF  [C1206]  10.5 42.37 270 top
C7  100nF  [C1206]  15.33 40.72 180 top
C8  100nF  [C0805]  8.22 17.35 180 top
C9  100nF  [C0805]  9.61 20.91 90 top
C10  100nF  [C1206]  8.34 13.79 0 top
C11  100nF  [C1206]  21.04 12.52 90 top
C20  100nF  [C0805]  26.95 21.92 270 top
C21  100nF  [C0805]  24.28 21.92 270 top
C22  100nF  [C0805]  30.26 21.92 270 top
C23  100nF  [C0805]  32.91 21.92 270 top
C26  100nF  [C0805]  36.35 21.92 270 top
C27  100nF  [C0805]  39.01 21.92 270 top
C29  100nF  [C0603]  39.71 37.29 0 top
C30  100nF  [C0603]  46.08 24.83 0 top
C31  10uf  [C0603]  39.71 35.26 0 top
C32  10uf  [C0603]  46.08 22.33 0 top
C33  100nF  [C0603]  51.39 34.35 0 top
C34  10uf  [C0603]  51.4 32.17 0 top
C35  100nF  [C1206]  22.82 40.72 180 top
C36  100nF  [C0603]  24.09 29.54 0 top
D1  ES3JB  [SMB_L4.6-W3.6-LS5.3-RD]  19.9 33.48 90 top
H1  -  [HDR-TH_4P-P2.54-V-F]  54.95 21.03 180 top
KEY1  B3F-4000  [KEY-TH_4P-L12.0-W12.0-P5.00-LS13.4-EH]  55.3 58.1 0 bottom
L1  10uH  [L0805]  39.72 32.73 180 top
L3  470uH  [IND-SMD_L10.4-W10.3]  16.47 22.56 270 top
LED5  -  [LED_0603]  17.49 11.51 0 top
LED6  -  [LED_0603]  17.49 9.6 0 top
LED7  -  [LED_0603]  17.49 7.57 0 top
LED8  -  [LED_0603]  28.29 38.45 0 top
LED9  NCD0805R1  [LED0805-R-RD]  55.33 35.89 180 bottom
LED10  NCD0805R1  [LED0805-R-RD]  55.46 29.92 180 bottom
LED11  NCD0805R1  [LED0805-R-RD]  55.72 23.95 180 bottom
LED12  NCD0805R1  [LED0805-R-RD]  55.72 17.98 180 bottom
Q1  E100N1P5OH1  [TOLL-8_L10.4-W9.9-P1.20-LS11.7-BL]  71.63 19.09 0 top
Q3  E100N1P5OH1  [TOLL-8_L10.4-W9.9-P1.20-LS11.7-BL]  82.85 19.09 0 top
Q4  AO3404  [SOT-23-3_L2.9-W1.3-P1.90-LS2.4-BR]  45.17 18.24 180 top
R1  100  [R0603]  59.65 15.44 180 top
R2  100  [R0603]  59.61 17.61 180 top
R3  10K  [R0805]  6.06 37.16 180 top
R4  10K  [R0805]  6.06 33.86 0 top
R5  10K  [R0805]  6.06 31.06 0 top
R6  10K  [R0805]  7.2 20.91 90 top
R7  10K  [R0805]  7.88 26.44 270 top
R8  10K  [R0805]  5.34 26.44 90 top
R9  10K  [R0805]  32.98 37.54 0 top
R10  10K  [R0805]  32.98 40.72 0 top
R11  10K  [R0805]  40.73 29.92 180 top
R12  10K  [R0603]  56.71 16.51 90 top
R13  10K  [R0603]  54.65 16.51 90 top
R14  10K  [R0603]  52.59 16.51 90 top
R15  10K  [R0603]  50.53 16.51 90 top
R16  10K  [R0805]  53.18 30.05 180 top
R17  10K  [R0805]  40.73 27.51 180 top
R18  10K  [R0805]  53.18 43.26 90 top
R19  10K  [R0805]  54.57 38.43 90 top
R20  100  [R0805]  51.91 38.43 270 top
R21  10K  [R0805]  37.55 40.72 180 top
R22  10K  [R0603]  14.06 11.51 0 top
R23  10K  [R0603]  14.06 9.6 0 top
R24  10K  [R0603]  14.06 7.57 0 top
R25  10K  [R0603]  28.16 40.97 180 top
R26  10K  [R0805]  34.38 30.56 0 top
R27  10K  [R0603]  48.35 16.51 90 top
R28  10K  [R0603]  48.35 20.02 270 top
R29  10K  [R0603]  42 18.24 90 top
R30  10K  [R0603]  45.81 14.05 270 top
R31  10K  [R0603]  43.27 14.05 270 top
R32  10K  [R0603]  36.54 37.67 270 top
R33  10K  [R0805]  48.98 44.27 180 top
SCREW1  -  [M3螺丝]  7.26 3.22 0 top
SCREW2  -  [M3螺丝]  39.31 3.3 0 top
SCREW3  -  [M3螺丝]  71.08 3.12 0 top
SCREW4  -  [M3螺丝]  103.16 3.22 0 top
SCREW5  -  [M3螺丝]  7.27 50.8 0 top
SCREW6  -  [M3螺丝]  39.46 50.82 0 top
SCREW7  -  [M3螺丝]  71.06 50.82 0 top
SCREW8  -  [M3螺丝]  103.16 50.82 0 top
SW1  TS-1101-C-W  [SW-SMD_L6.0-W3.3-LS8.0]  32.47 27.51 0 top
U3  STM32L031G6U6  [UFQFPN-28_L4.0-W4.0-P0.50-BL]  45.94 29.41 180 top
U4  TPS54360DDAR  [SOIC-8_L5.0-W4.0-P1.27-LS6.0-BL-EP2.0]  11.58 34.27 180 top
U5  EC190708- 15FF-1925  [SOT-23-6_L2.9-W1.6-P0.95-LS2.9-BL]  32.98 33.99 180 top
U6  AMS1117-5.0  [SOT-223_L6.5-W3.5-P2.30-LS7.0-BR]  27.14 13.92 90 top
U7  AMS1117-5.0  [SOT-223_L6.5-W3.5-P2.30-LS7.0-BR]  36.16 13.92 90 top
U8  XT60PB-M.G.Y  [CONN-TH_XT60PB-M]  99.15 15.44 0 top
U9  XT60-F  [CONN-TH_XT60PB-F]  99.15 37.8 0 top
U10  NDP6802SF-A2  [SOT-89-3_L4.5-W2.4-P1.50-LS4.0-BR]  25.74 34.11 180 top
U11  HT7333-3  [SOT-89-3_L4.5-W2.5-P1.50-LS4.2-BR]  29.3 30.68 0 top
X1  32MHz  [CRYSTAL-SMD_4P-L3.2-W2.5-BL]  46.58 36.03 180 top

## Footprints (pads in the part's own frame, mm; a bottom-side part is the same pattern mirrored in y, then rotated)
C0603
  rect 0.8x0.9 smd: 1(-0.7,0) 2(0.7,0)
C0805
  rect 1.41x1.35 smd: 1(-1,0) 2(1,0)
C1206
  rect 1.485x1.728 smd: 1(-1.593,0) 2(1.593,0)
CONN-TH_XT60PB-F
  round 5.516 hole 4.505x4: +(3.6,0) -(-3.6,0)
CONN-TH_XT60PB-M
  round 5.516 hole 4.505x4: 1(3.6,0) 2(-3.6,0)
CRYSTAL-SMD_4P-L3.2-W2.5-BL
  rect 1.4x1.2 smd: 1(-1.1,-0.85) 2(1.1,-0.85) 3(1.1,0.85) 4(-1.1,0.85)
HDR-TH_4P-P2.54-V-F
  rect 1.7x1.7 hole 1.1: 1(-3.81,0)
  round 1.7 hole 1.1: 2(-1.27,0) 3(1.27,0) 4(3.81,0)
IND-SMD_L10.4-W10.3
  rect 2.124x3.42 smd: 1(-4.978,0) 2(4.978,0)
KEY-TH_4P-L12.0-W12.0-P5.00-LS13.4-EH
  round 2 hole 1.3: 1(6.25,-2.5) 2(-6.25,-2.5) 3(6.25,2.5) 4(-6.25,2.5)
L0805
  rect 1.133x1.377 smd: 1(-0.966,0) 2(0.966,0)
LED0805-R-RD
  rect 1x1.399 smd: 1(1.05,0) 2(-1.05,0)
LED_0603
  rect 0.8x0.8 smd: 1(-0.851,-0.01) 2(0.75,-0.005)
M3螺丝
  round 3.2 hole 3.2: 1(0,0)
R0603
  rect 0.806x0.864 smd: 1(-0.753,0) 2(0.753,0)
R0805
  rect 1.133x1.377 smd: 1(-1,0) 2(1,0)
SMB_L4.6-W3.6-LS5.3-RD
  rect 2.047x2.192 smd: 1(-2.361,0) 2(2.361,0)
SOIC-8_L5.0-W4.0-P1.27-LS6.0-BL-EP2.0
  oval 0.574x2.038 smd: 1(-1.905,-2.769) 2(-0.635,-2.769) 3(0.635,-2.769) 4(1.905,-2.769) 5(1.905,2.769) 6(0.635,2.769) 7(-0.635,2.769) 8(-1.905,2.769)
  rect 2x2 smd: 9(0,0)
SOT-23-3_L2.9-W1.3-P1.90-LS2.4-BR
  rect 1.25x0.7 smd: 1(1,-0.95) 2(1,0.95) 3(-1,0)
SOT-23-6_L2.9-W1.6-P0.95-LS2.9-BL
  rect 0.532x1.072 smd: 1(-0.95,-1.149) 2(0,-1.149) 3(0.95,-1.149) 4(0.95,1.149) 5(0,1.149) 6(-0.95,1.149)
SOT-89-3_L4.5-W2.4-P1.50-LS4.0-BR
  rect 1.575x0.672 smd: 1(1.357,-1.5) 3(1.357,1.5)
  custom 5.377x1.9 smd: 2(-1.357,-0.001)
SOT-89-3_L4.5-W2.5-P1.50-LS4.2-BR
  rect 1.575x0.672 smd: 1(1.356,-1.5) 3(1.356,1.5)
  custom 5.377x1.9 smd: 2(-1.356,0)
SOT-223_L6.5-W3.5-P2.30-LS7.0-BR
  rect 2.465x1.05 smd: 1(2.857,-2.3) 2(2.857,0) 3(2.857,2.3)
  rect 2.465x3.54 smd: 4(-2.857,0)
SW-SMD_L6.0-W3.3-LS8.0
  rect 1.9x1.5 smd: 1(-4,0) 2(4,0)
TOLL-8_L10.4-W9.9-P1.20-LS11.7-BL
  rect 0.9x2.2 smd: 1(-4.225,-3.65) 8(4.225,-3.65)
  rect 0.8x2.2 smd: 2(-3,-3.65) 3(-1.8,-3.65) 4(-0.6,-3.65) 5(0.6,-3.65) 6(1.8,-3.65) 7(3,-3.65)
  rect 8.08x0.8 smd: 8(0.64,-2.95)
  rect 10x8.5 smd: 9(0,3.65)
UFQFPN-28_L4.0-W4.0-P0.50-BL
  custom 0.3x0.675 smd: 1(-1.5,-1.875) 7(1.5,-1.875) 15(1.5,1.875) 21(-1.5,1.875)
  rect 0.3x0.7 smd: 2(-1,-1.925) 3(-0.5,-1.925) 4(0,-1.925) 5(0.5,-1.925) 6(1,-1.925) 16(1,1.925) 17(0.5,1.925) 18(0,1.925) 19(-0.5,1.925) 20(-1,1.925)
  custom 0.675x0.3 smd: 8(1.875,-1.5) 14(1.875,1.5) 22(-1.875,1.5) 28(-1.875,-1.5)
  rect 0.7x0.3 smd: 9(1.925,-1) 10(1.925,-0.5) 11(1.925,0) 12(1.925,0.5) 13(1.925,1) 24(-1.925,0.5) 25(-1.925,0) 26(-1.925,-0.5) 27(-1.925,-1)
  custom 0.7x0.3 smd: 23(-1.925,1)

## Nets
As in the schematic, except:
LED0: LED12.1 U3.23
LED1: LED11.1 U3.24
LED2: LED10.1 U3.25
LED3: LED9.1 U3.26
$1N9917: LED12.2 R15.1
$1N9919: LED11.2 R14.1
$1N9921: LED10.2 R13.1
$1N9923: LED9.2 R12.1

Pads without a net: SCREW1 1; SCREW2 1; SCREW3 1; SCREW4 1; SCREW5 1; SCREW6 1; SCREW7 1; SCREW8 1; U3 7 8 9 11 12 14 18 19 20; U5 4 6

## Via types
v1: diameter 0.61, hole 0.305, Top Layer to Bottom Layer, 1002 vias

## Routing (per net, layer and track width the routed paths; a pad name or vN(x,y) marks a point on that pad's centre or on a via; arc(x,y) is an arc through that point)
3V3: length 109
  Top Layer w0.254: L1.2 37.48,32.73 v1(37.46,32.75) ; 40.84,20.92 40.84,23.84 39.97,24.72 35.12,24.72 34.38,25.45 34.38,28.65 35.38,29.65 R26.2 ; U7.4 36.16,8.97 34.76,7.56 LED7.2 ; R17.1 41.73,25.11 42,24.84 45.36,24.84 C30.1 45.44,24.89 U3.17 ; C34.1 47.68,32.17 47.44,31.93 U3.1
  Top Layer w0.381: C33.1 50.7,34.33 v1(50.7,33.25) C34.1 ; C30.1 C32.1 45.38,21.49 v1(44.81,20.92) C27.2
  Top Layer w0.635: C27.2 C26.2 36.35,19.19 36.16,19 U7.2 U7.4
  Bottom Layer w0.254: v1(37.46,32.75) 37.9,32.75 43.27,27.38 43.27,22.46 v1(44.81,20.92)
  Bottom Layer w0.381: v1(50.7,33.25) 50.7,21.47 H1.4 51.03,20.92 v1(44.81,20.92)
3V3A: length 10.4
  Top Layer w0.254: C29.2 C31.2 40.41,33.01 L1.1 40.7,32.72 v1(41.75,32.72) ; U3.5 45.44,32.07 v1(45.3,32.21)
  Bottom Layer w0.254: v1(41.75,32.72) 44.79,32.72 v1(45.3,32.21)
3V32: length 12.5
  Top Layer w0.254: 33.03,31.75 33.18,31.75 33.38,31.56 R26.1 ; 33.03,31.75 33.03,32.78 U5.5 ; 33.03,31.75 31.89,31.75 31.71,31.57 30.82,31.57 30.66,31.74 U11.3 30.7,32.22 30.7,33.1 30.19,33.61 30.19,37.3 LED8.2
12V: length 10
  Top Layer w0.254: 24.66,30.62 24.39,30.9 U10.3 ; 24.66,30.62 27.88,30.62 U11.2 ; 24.66,30.62 24.66,28.33 23.85,27.53 23.85,26.37
+5V: length 29.1
  Top Layer w0.254: LED6.2 23.07,9.6 24.54,11.06 U6.4
  Top Layer w0.635: U7.3 33.86,18.63 32.91,19.58 C23.2 C22.2 30.26,19.58 29.81,19.13 27.65,19.13 27.14,18.62 U6.2 U6.4
+15V: length 57.4
  Top Layer w0.254: v1(46.83,13.28) 45.82,13.28 R30.2 ; LED5.2 18.24,13.41 18.12,13.41
  Top Layer w0.381: R7.2 7.88,24.13 7.46,23.7 5.93,23.7 5.3,23.06 5.3,16.33 6.06,15.57 9.61,15.57 9.94,15.25 C10.2
  Top Layer w0.635: C11.2 21.04,16.46 ; C20.2 C21.2 24.28,19.57 24.85,19 24.85,16.79 U6.3 ; C10.2 12.15,13.79
  Bottom Layer w0.254: v1(46.83,13.28) 26.76,13.28 v1(23.2,16.84)
AGND:
  vias: v1(67.7,36.4) v1(67.7,35.38) v1(67.7,34.37) v1(67.7,33.35) v1(67.7,32.33) v1(67.7,31.32) v1(67.7,30.3) v1(67.7,29.29) v1(67.7,28.27) v1(67.7,27.25) v1(67.7,26.24) v1(67.7,25.22) v1(67.7,24.21) v1(67.7,23.19) v1(67.7,22.17) v1(67.7,21.16) v1(67.7,20.14) v1(68.71,37.42) v1(68.71,36.4) v1(68.71,35.38) v1(68.71,34.37) v1(68.71,33.35) v1(68.71,32.33) v1(68.71,31.32) v1(68.71,30.3) v1(68.71,29.29) v1(68.71,28.27) v1(68.71,27.25) v1(68.71,26.24) v1(68.71,25.22) v1(68.71,24.21) v1(68.71,23.19) v1(68.71,22.17) v1(68.71,21.16) v1(68.71,20.14) v1(69.73,38.43) v1(69.73,37.42) v1(69.73,36.4) v1(69.73,35.38) v1(69.73,34.37) v1(69.73,33.35) v1(69.73,32.33) v1(69.73,31.32) v1(69.73,30.3) v1(69.73,29.29) v1(69.73,28.27) v1(69.73,27.25) v1(69.73,26.24) v1(69.73,25.22) v1(69.73,24.21) v1(69.73,23.19) v1(69.73,22.17) v1(69.73,21.16) v1(69.73,20.14) v1(70.75,39.45) v1(70.75,38.43) v1(70.75,37.42) v1(70.75,36.4) v1(70.75,35.38) v1(70.75,34.37) v1(70.75,33.35) v1(70.75,32.33) v1(70.75,31.32) v1(70.75,30.3) v1(70.75,29.29) v1(70.75,28.27) v1(70.75,27.25) v1(70.75,26.24) v1(70.75,25.22) v1(70.75,24.21) v1(70.75,23.19) v1(70.75,22.17) v1(70.75,21.16) v1(70.75,20.14) v1(71.76,39.45) v1(71.76,38.43) v1(71.76,37.42) v1(71.76,36.4) v1(71.76,35.38) v1(71.76,34.37) v1(71.76,33.35) v1(71.76,32.33) v1(71.76,31.32) v1(71.76,30.3) v1(71.76,29.29) v1(71.76,28.27) v1(71.76,27.25) v1(71.76,26.24) v1(71.76,25.22) v1(71.76,24.21) v1(71.76,23.19) v1(71.76,22.17) v1(71.76,21.16) v1(71.76,20.14) v1(72.78,39.45) v1(72.78,38.43) v1(72.78,37.42) v1(72.78,36.4) v1(72.78,35.38) v1(72.78,34.37) v1(72.78,33.35) v1(72.78,32.33) v1(72.78,31.32) v1(72.78,30.3) v1(72.78,29.29) v1(72.78,28.27) v1(72.78,27.25) v1(72.78,26.24) v1(72.78,25.22) v1(72.78,24.21) v1(72.78,23.19) v1(72.78,22.17) v1(72.78,21.16) v1(72.78,20.14) v1(73.79,39.45) v1(73.79,38.43) v1(73.79,37.42) v1(73.79,36.4) v1(73.79,35.38) v1(73.79,34.37) v1(73.79,33.35) v1(73.79,32.33) v1(73.79,31.32) v1(73.79,30.3) v1(73.79,29.29) v1(73.79,28.27) v1(73.79,27.25) v1(73.79,26.24) v1(73.79,25.22) v1(73.79,24.21) v1(73.79,23.19) v1(73.79,22.17) v1(73.79,21.16) v1(73.79,20.14) v1(74.81,39.45) v1(74.81,38.43) v1(74.81,37.42) v1(74.81,36.4) v1(74.81,35.38) v1(74.81,34.37) v1(74.81,33.35) v1(74.81,32.33) v1(74.81,31.32) v1(74.81,30.3) v1(74.81,29.29) v1(74.81,28.27) v1(74.81,27.25) v1(74.81,26.24) v1(74.81,25.22) v1(74.81,24.21) v1(74.81,23.19) v1(74.81,22.17) v1(74.81,21.16) v1(74.81,20.14) v1(75.83,39.45) v1(75.83,38.43) v1(75.83,37.42) v1(75.83,36.4) v1(75.83,35.38) v1(75.83,34.37) v1(75.83,33.35) v1(75.83,32.33) v1(75.83,31.32) v1(75.83,30.3) v1(75.83,29.29) v1(75.83,28.27) v1(75.83,27.25) v1(75.83,26.24) v1(75.83,25.22) v1(75.83,24.21) v1(75.83,23.19) v1(75.83,22.17) v1(75.83,21.16) v1(75.83,20.14) v1(76.84,39.45) v1(76.84,38.43) v1(76.84,37.42) v1(76.84,36.4) v1(76.84,35.38) v1(76.84,34.37) v1(76.84,33.35) v1(76.84,32.33) v1(76.84,31.32) v1(76.84,30.3) v1(76.84,29.29) v1(76.84,28.27) v1(76.84,27.25) v1(76.84,26.24) v1(76.84,25.22) v1(76.84,24.21) v1(76.84,23.19) v1(76.84,22.17) v1(76.84,21.16) v1(76.84,20.14) v1(77.86,39.45) v1(77.86,38.43) v1(77.86,37.42) v1(77.86,36.4) v1(77.86,35.38) v1(77.86,34.37) v1(77.86,33.35) v1(77.86,32.33) v1(77.86,31.32) v1(77.86,30.3) v1(77.86,29.29) v1(77.86,28.27) v1(77.86,27.25) v1(77.86,26.24) v1(77.86,25.22) v1(77.86,24.21) v1(77.86,23.19) v1(77.86,22.17) v1(77.86,21.16) v1(77.86,20.14) v1(78.87,39.45) v1(78.87,38.43) v1(78.87,37.42) v1(78.87,36.4) v1(78.87,35.38) v1(78.87,34.37) v1(78.87,33.35) v1(78.87,32.33) v1(78.87,31.32) v1(78.87,30.3) v1(78.87,29.29) v1(78.87,28.27) v1(78.87,27.25) v1(78.87,26.24) v1(78.87,25.22) v1(78.87,24.21) v1(78.87,23.19) v1(78.87,22.17) v1(78.87,21.16) v1(78.87,20.14) v1(79.89,39.45) v1(79.89,38.43) v1(79.89,37.42) v1(79.89,36.4) v1(79.89,35.38) v1(79.89,34.37) v1(79.89,33.35) v1(79.89,32.33) v1(79.89,31.32) v1(79.89,30.3) v1(79.89,29.29) v1(79.89,28.27) v1(79.89,27.25) v1(79.89,26.24) v1(79.89,25.22) v1(79.89,24.21) v1(79.89,23.19) v1(79.89,22.17) v1(79.89,21.16) v1(79.89,20.14) v1(80.91,39.45) v1(80.91,38.43) v1(80.91,37.42) v1(80.91,36.4) v1(80.91,35.38) v1(80.91,34.37) v1(80.91,33.35) v1(80.91,32.33) v1(80.91,31.32) v1(80.91,30.3) v1(80.91,29.29) v1(80.91,28.27) v1(80.91,27.25) v1(80.91,26.24) v1(80.91,25.22) v1(80.91,24.21) v1(80.91,23.19) v1(80.91,22.17) v1(80.91,21.16) v1(80.91,20.14) v1(81.92,39.45) v1(81.92,38.43) v1(81.92,37.42) v1(81.92,36.4) v1(81.92,35.38) v1(81.92,34.37) v1(81.92,33.35) v1(81.92,32.33) v1(81.92,31.32) v1(81.92,30.3) v1(81.92,29.29) v1(81.92,28.27) v1(81.92,27.25) v1(81.92,26.24) v1(81.92,25.22) v1(81.92,24.21) v1(81.92,23.19) v1(81.92,22.17) v1(81.92,21.16) v1(81.92,20.14) v1(82.94,39.45) v1(82.94,38.43) v1(82.94,37.42) v1(82.94,36.4) v1(82.94,35.38) v1(82.94,34.37) v1(82.94,33.35) v1(82.94,32.33) v1(82.94,31.32) v1(82.94,30.3) v1(82.94,29.29) v1(82.94,28.27) v1(82.94,27.25) v1(82.94,26.24) v1(82.94,25.22) v1(82.94,24.21) v1(82.94,23.19) v1(82.94,22.17) v1(82.94,21.16) v1(82.94,20.14) v1(83.95,39.45) v1(83.95,38.43) v1(83.95,37.42) v1(83.95,36.4) v1(83.95,35.38) v1(83.95,34.37) v1(83.95,33.35) v1(83.95,32.33) v1(83.95,31.32) v1(83.95,30.3) v1(83.95,29.29) v1(83.95,28.27) v1(83.95,27.25) v1(83.95,26.24) v1(83.95,25.22) v1(83.95,24.21) v1(83.95,23.19) v1(83.95,22.17) v1(83.95,21.16) v1(83.95,20.14) v1(84.97,39.45) v1(84.97,38.43) v1(84.97,37.42) v1(84.97,36.4) v1(84.97,35.38) v1(84.97,34.37) v1(84.97,33.35) v1(84.97,32.33) v1(84.97,31.32) v1(84.97,30.3) v1(84.97,29.29) v1(84.97,28.27) v1(84.97,27.25) v1(84.97,26.24) v1(84.97,25.22) v1(84.97,24.21) v1(84.97,23.19) v1(84.97,22.17) v1(84.97,21.16) v1(84.97,20.14) v1(85.99,39.45) v1(85.99,38.43) v1(85.99,37.42) v1(85.99,36.4) v1(85.99,35.38) v1(85.99,34.37) v1(85.99,33.35) v1(85.99,32.33) v1(85.99,31.32) v1(85.99,30.3) v1(85.99,29.29) v1(85.99,28.27) v1(85.99,27.25) v1(85.99,26.24) v1(85.99,25.22) v1(85.99,24.21) v1(85.99,23.19) v1(85.99,22.17) v1(85.99,21.16) v1(85.99,20.14) v1(87,39.45) v1(87,38.43) v1(87,37.42) v1(87,36.4) v1(87,35.38) v1(87,34.37) v1(87,33.35) v1(87,32.33) v1(87,31.32) v1(87,30.3) v1(87,29.29) v1(87,28.27) v1(87,27.25) v1(87,26.24) v1(87,25.22) v1(87,24.21) v1(87,23.19) v1(87,22.17) v1(87,21.16) v1(87,20.14) v1(88.02,39.45) v1(88.02,38.43) v1(88.02,37.42) v1(88.02,36.4) v1(88.02,35.38) v1(88.02,34.37) v1(88.02,33.35) v1(88.02,32.33) v1(88.02,31.32) v1(88.02,30.3) v1(88.02,29.29) v1(88.02,28.27) v1(88.02,27.25) v1(88.02,26.24) v1(88.02,25.22) v1(88.02,24.21) v1(88.02,23.19) v1(88.02,22.17) v1(88.02,21.16) v1(88.02,20.14) v1(89.03,39.45) v1(89.03,38.43) v1(89.03,37.42) v1(89.03,36.4) v1(89.03,35.38) v1(89.03,34.37) v1(89.03,33.35) v1(89.03,32.33) v1(89.03,31.32) v1(89.03,30.3) v1(89.03,29.29) v1(89.03,28.27) v1(89.03,27.25) v1(89.03,26.24) v1(89.03,25.22) v1(89.03,24.21) v1(89.03,23.19) v1(89.03,22.17) v1(89.03,21.16) v1(89.03,20.14) v1(90.05,39.45) v1(90.05,38.43) v1(90.05,37.42) v1(90.05,36.4) v1(90.05,35.38) v1(90.05,34.37) v1(90.05,33.35) v1(90.05,32.33) v1(90.05,31.32) v1(90.05,30.3) v1(90.05,29.29) v1(90.05,28.27) v1(90.05,27.25) v1(90.05,26.24) v1(90.05,25.22) v1(90.05,24.21) v1(90.05,23.19) v1(90.05,22.17) v1(90.05,21.16) v1(90.05,20.14) v1(91.07,39.45) v1(91.07,38.43) v1(91.07,37.42) v1(91.07,36.4) v1(91.07,35.38) v1(91.07,34.37) v1(91.07,33.35) v1(91.07,32.33) v1(91.07,31.32) v1(91.07,30.3) v1(91.07,29.29) v1(91.07,28.27) v1(91.07,27.25) v1(91.07,26.24) v1(91.07,25.22) v1(91.07,24.21) v1(91.07,23.19) v1(91.07,22.17) v1(91.07,21.16) v1(92.08,39.45) v1(92.08,38.43) v1(92.08,37.42) v1(92.08,36.4) v1(92.08,35.38) v1(92.08,34.37) v1(92.08,33.35) v1(92.08,32.33) v1(92.08,31.32) v1(92.08,30.3) v1(92.08,29.29) v1(92.08,28.27) v1(92.08,27.25) v1(92.08,26.24) v1(92.08,25.22) v1(92.08,24.21) v1(92.08,23.19) v1(92.08,22.17) v1(93.1,34.37) v1(93.1,33.35) v1(93.1,32.33) v1(93.1,31.32) v1(93.1,30.3) v1(93.1,29.29) v1(93.1,28.27) v1(93.1,27.25) v1(93.1,26.24) v1(93.1,25.22) v1(93.1,24.21) v1(93.1,23.19) v1(94.11,34.37) v1(94.11,33.35) v1(94.11,32.33) v1(94.11,31.32) v1(94.11,30.3) v1(94.11,29.29) v1(94.11,28.27) v1(94.11,27.25) v1(94.11,26.24) v1(94.11,25.22) v1(94.11,24.21) v1(95.13,34.37) v1(95.13,33.35) v1(95.13,32.33) v1(95.13,31.32) v1(95.13,30.3) v1(95.13,29.29) v1(95.13,28.27) v1(95.13,27.25) v1(95.13,26.24) v1(95.13,25.22) v1(96.15,34.37) v1(96.15,33.35) v1(96.15,32.33) v1(96.15,31.32) v1(96.15,30.3) v1(96.15,29.29) v1(96.15,28.27) v1(96.15,27.25) v1(96.15,26.24) v1(97.16,34.37) v1(97.16,33.35) v1(97.16,32.33) v1(97.16,31.32) v1(97.16,30.3) v1(97.16,29.29) v1(97.16,28.27) v1(97.16,27.25) v1(98.18,34.37) v1(98.18,33.35) v1(98.18,32.33) v1(98.18,31.32) v1(98.18,30.3) v1(98.18,29.29)
GND: length 35.9
  Top Layer w0.254: v1(44.67,25.98) 44.94,26.25 U3.16 ; U3.28 48.45,30.91 v1(48.86,31.32)
  Top Layer w0.381: R8.1 5.36,25.43 v1(6.61,25.43) ; v1(10.88,19.89) 9.63,19.89 C9.1 9.61,18.75 9.22,18.35 C8.1 ; R4.1 R5.1
  Top Layer w0.635: v1(11.77,29.92) 12.22,30.37 12.22,30.49 ; D1.2 v1(19.9,37.42) ; v1(19.9,37.42) v1(18.89,37.42) ; v1(19.9,37.42) v1(21.04,37.42) ; 12.22,30.49 v1(12.79,29.92) ; 12.22,30.49 U4.7
  Top Layer w1: 74.38,9.73 74.26,9.86 55.72,9.86
  vias: v1(2.38,29.67) v1(2.63,22.3) v1(3.39,42.62) v1(3.9,10.62) v1(5.04,32.46) v1(6.57,45.42) v1(10.63,27.38) v1(10.63,24.08) v1(10.63,16.08) v1(10.76,18.49) v1(10.88,21.03) v1(11.39,14.81) v1(11.77,12.65) v1(11.9,10.49) v1(12.03,8.46) v1(13.04,28.27) v1(14.06,10.49) v1(14.06,8.59) v1(14.95,46.05) v1(15.71,10.49) v1(15.84,8.59) v1(16.73,42.75) v1(19.39,12.27) v1(19.39,10.49) v1(19.39,8.59) v1(20.41,28.27) v1(21.3,42.75) v1(21.81,6.81) v1(22.06,18.75) v1(22.19,26.24) v1(22.19,22.05) v1(22.57,8.59) v1(22.82,37.03) v1(22.95,14.05) v1(23.71,18.75) v1(26,37.03) v1(26.12,32.33) v1(26.38,42.75) v1(28.28,26.11) v1(28.66,21.92) v1(28.66,8.46) v1(28.92,37.03) v1(29.3,42.5) v1(29.3,25.6) v1(29.81,6.94) v1(30.57,39.32) v1(31.08,36.02) v1(31.08,33.99) v1(31.08,16.97) v1(31.59,11) v1(32.98,36.27) v1(33.36,46.56) v1(33.49,26.62) v1(34,8.59) v1(34.51,21.79) v1(35.34,33.93) v1(35.4,32.97) v1(35.65,35.26) v1(36.28,25.98) v1(36.79,42.5) v1(37.55,31.06) v1(37.68,21.92) v1(39.21,8.21) v1(40.09,16.71) v1(40.35,25.86) v1(41.75,22.94) v1(42,16.21) v1(42.25,36.65) v1(42.25,35.51) v1(42.38,34.49) v1(42.51,25.73) v1(42.76,37.67) v1(43.02,29.41) v1(43.14,31.57) v1(43.27,34.24) v1(43.52,42.5) v1(43.9,37.67) v1(44.22,35.91) v1(44.16,34.37) v1(44.41,23.44) v1(44.79,38.3) v1(44.79,33.73) v1(44.79,15.95) v1(45.17,8.46) v1(45.3,46.18) v1(45.43,39.32) v1(45.94,40.46) v1(45.94,38.3) v1(46.44,26.24) v1(46.57,30.3) v1(46.7,23.57) v1(46.95,38.3) v1(47.08,16.08) v1(47.21,40.46) v1(47.46,33.99) v1(47.71,32.97) v1(48.35,33.99) v1(48.48,42.5) v1(48.48,40.46) v1(48.48,27) v1(48.6,38.3) v1(48.73,39.32) v1(48.73,23.95) v1(48.98,37.16) v1(48.98,35.76) v1(48.98,34.49) v1(50,42.5) v1(50,40.34) v1(50.51,11.13) v1(51.26,35.77) v1(51.27,8.46) v1(51.52,24.97) v1(51.86,62.62) v1(52.16,22.68) v1(52.26,57.62) v1(52.29,20.02) v1(53.18,49.48) v1(53.18,38.43) v1(55.08,25.35) v1(55.33,22.81) v1(56.6,25.86) v1(56.99,22.68) v1(57.37,19.89) v1(57.96,57.62) v1(58.89,47.19) v1(59.06,62.52) v1(60.54,32.72) v1(60.54,11.51) v1(60.54,7.95) v1(61.05,40.59) v1(61.05,27.25) v1(61.05,20.91) v1(69.3,15.7) v1(69.3,14.68) v1(69.3,13.67) v1(69.3,12.65) v1(69.3,11.63) v1(69.3,10.62) v1(69.3,9.6) v1(69.3,8.59) v1(70.32,15.7) v1(70.32,14.68) v1(70.32,13.67) v1(70.32,12.65) v1(70.32,11.63) v1(70.32,10.62) v1(70.32,9.6) v1(70.32,8.59) v1(71.34,15.7) v1(71.34,14.68) v1(71.34,13.67) v1(71.34,12.65) v1(71.34,11.63) v1(71.34,10.62) v1(71.34,9.6) v1(71.34,8.59) v1(72.35,15.7) v1(72.35,14.68) v1(72.35,13.67) v1(72.35,12.65) v1(72.35,11.63) v1(72.35,10.62) v1(72.35,9.6) v1(72.35,8.59) v1(73.37,15.7) v1(73.37,14.68) v1(73.37,13.67) v1(73.37,12.65) v1(73.37,11.63) v1(73.37,10.62) v1(73.37,9.6) v1(73.37,8.59) v1(74.38,15.7) v1(74.38,14.68) v1(74.38,13.67) v1(74.38,12.65) v1(74.38,11.63) v1(74.38,10.62) v1(74.38,9.6) v1(74.38,8.59) v1(75.4,15.7) v1(75.4,14.68) v1(75.4,13.67) v1(75.4,12.65) v1(75.4,11.63) v1(75.4,10.62) v1(75.4,9.6) v1(75.4,8.59) v1(76.42,15.7) v1(76.42,14.68) v1(76.42,13.67) v1(76.42,12.65) v1(76.42,11.63) v1(76.42,10.62) v1(76.42,9.6) v1(76.42,8.59) v1(77.43,13.67) v1(77.43,12.65) v1(77.43,11.63) v1(77.43,10.62) v1(77.43,9.6) v1(77.43,8.59) v1(78.45,13.67) v1(78.45,12.65) v1(78.45,11.63) v1(78.45,10.62) v1(78.45,9.6) v1(78.45,8.59) v1(79.46,13.67) v1(79.46,12.65) v1(79.46,11.63) v1(79.46,10.62) v1(79.46,9.6) v1(79.46,8.59) v1(79.97,15.7) v1(79.97,14.68) v1(80.48,13.67) v1(80.48,12.65) v1(80.48,11.63) v1(80.48,10.62) v1(80.48,9.6) v1(80.48,8.59) v1(80.99,15.7) v1(80.99,14.68) v1(81.5,13.67) v1(81.5,12.65) v1(81.5,11.63) v1(81.5,10.62) v1(81.5,9.6) v1(81.5,8.59) v1(82,15.7) v1(82,14.68) v1(82.51,13.67) v1(82.51,12.65) v1(82.51,11.63) v1(82.51,10.62) v1(82.51,9.6) v1(82.51,8.59) v1(83.02,15.7) v1(83.02,14.68) v1(83.53,13.67) v1(83.53,12.65) v1(83.53,11.63) v1(83.53,10.62) v1(83.53,9.6) v1(83.53,8.59) v1(84.04,15.7) v1(84.04,14.68) v1(84.54,13.67) v1(84.54,12.65) v1(84.54,11.63) v1(84.54,10.62) v1(84.54,9.6) v1(84.54,8.59) v1(85.05,15.7) v1(85.05,14.68) v1(85.56,13.67) v1(85.56,12.65) v1(85.56,11.63) v1(85.56,10.62) v1(85.56,9.6) v1(85.56,8.59) v1(86.07,15.7) v1(86.07,14.68) v1(86.58,13.67) v1(86.58,12.65) v1(86.58,11.63) v1(86.58,10.62) v1(86.58,9.6) v1(86.58,8.59) v1(87.08,15.7) v1(87.08,14.68) v1(87.59,13.67) v1(87.59,12.65) v1(87.59,11.63) v1(87.59,10.62) v1(87.59,9.6) v1(87.59,8.59) v1(88.61,13.67) v1(88.61,12.65) v1(88.61,11.63) v1(88.61,10.62) v1(88.61,9.6) v1(88.61,8.59) v1(89.62,13.67) v1(89.62,12.65) v1(89.62,11.63) v1(89.62,10.62) v1(89.62,9.6) v1(89.62,8.59) v1(90.64,13.67) v1(90.64,12.65) v1(90.64,11.63) v1(90.64,10.62) v1(90.64,9.6) v1(90.64,8.59) v1(91.66,13.67) v1(91.66,12.65) v1(91.66,11.63) v1(91.66,10.62) v1(91.66,9.6) v1(91.66,8.59) v1(92.67,12.65) v1(92.67,11.63) v1(92.67,10.62) v1(92.67,9.6) v1(92.67,8.59) v1(93.69,11.63) v1(93.69,10.62) v1(93.69,9.6) v1(93.69,8.59) v1(94.7,11.63) v1(94.7,10.62) v1(94.7,9.6) v1(94.7,8.59) v1(95.72,11.63) v1(95.72,10.62) v1(95.72,9.6) v1(95.72,8.59) v1(96.74,11.63) v1(96.74,10.62) v1(96.74,9.6) v1(96.74,8.59)
VIN: length 58.6
  Top Layer w0.254: R33.1 53.16,44.27 R18.2 53.19,44.27 101.69,44.27 102.75,43.21 U9.+
  vias: v1(100.21,34.37) v1(100.21,33.35) v1(100.21,32.33) v1(100.21,31.32) v1(100.21,30.3) v1(100.21,29.29) v1(100.21,28.27) v1(100.21,27.25) v1(100.21,26.24) v1(100.21,25.22) v1(100.21,24.21) v1(100.21,23.19) v1(100.21,22.17) v1(100.21,21.16) v1(100.21,20.14) v1(100.21,19.13) v1(101.23,34.37) v1(101.23,33.35) v1(101.23,32.33) v1(101.23,31.32) v1(101.23,30.3) v1(101.23,29.29) v1(101.23,28.27) v1(101.23,27.25) v1(101.23,26.24) v1(101.23,25.22) v1(101.23,24.21) v1(101.23,23.19) v1(101.23,22.17) v1(101.23,21.16) v1(101.23,20.14) v1(101.23,19.13) v1(102.24,34.37) v1(102.24,33.35) v1(102.24,32.33) v1(102.24,31.32) v1(102.24,30.3) v1(102.24,29.29) v1(102.24,28.27) v1(102.24,27.25) v1(102.24,26.24) v1(102.24,25.22) v1(102.24,24.21) v1(102.24,23.19) v1(102.24,22.17) v1(102.24,21.16) v1(102.24,20.14) v1(102.24,19.13) v1(103.26,34.37) v1(103.26,33.35) v1(103.26,32.33) v1(103.26,31.32) v1(103.26,30.3) v1(103.26,29.29) v1(103.26,28.27) v1(103.26,27.25) v1(103.26,26.24) v1(103.26,25.22) v1(103.26,24.21) v1(103.26,23.19) v1(103.26,22.17) v1(103.26,21.16) v1(103.26,20.14) v1(103.26,19.13) v1(104.27,34.37) v1(104.27,33.35) v1(104.27,32.33) v1(104.27,31.32) v1(104.27,30.3) v1(104.27,29.29) v1(104.27,28.27) v1(104.27,27.25) v1(104.27,26.24) v1(104.27,25.22) v1(104.27,24.21) v1(104.27,23.19) v1(104.27,22.17) v1(104.27,21.16) v1(104.27,20.14) v1(104.27,19.13) v1(105.29,34.37) v1(105.29,33.35) v1(105.29,32.33) v1(105.29,31.32) v1(105.29,30.3) v1(105.29,29.29) v1(105.29,28.27) v1(105.29,27.25) v1(105.29,26.24) v1(105.29,25.22) v1(105.29,24.21) v1(105.29,23.19) v1(105.29,22.17) v1(105.29,21.16) v1(105.29,20.14) v1(105.29,19.13)
VIN_1: length 61.1
  Top Layer w0.254: C35.1 24.42,35.64 arc(24.41,35.62) U10.1
  Top Layer w0.381: C35.1 24.42,43.06 ; 24.42,43.06 24.42,43.07 25.62,44.27 R33.2 ; 24.42,43.06 23.2,44.27 14.82,44.27 13.74,43.19 C7.2 12.31,40.72 ; U4.2 12.22,40.62 12.31,40.72 ; 12.31,40.72 10.7,40.72 ; R3.2 5.04,37.18 5.04,40.21 5.61,40.78 C6.2
ADC: length 17.7
  Top Layer w0.254: v1(50.38,37.42) 51.89,37.42 R20.2 ; U3.15 44.44,27.03 v1(44.16,26.75)
  Bottom Layer w0.254: v1(50.38,37.42) 49.75,36.78 49.75,29.8 49.11,29.16 45.68,29.16 45.43,28.91 45.43,28.02 v1(44.16,26.75)
BOOT: length 4.5
  Top Layer w0.254: U3.27 50.14,30.41 50.51,30.05 R16.2
CLK: length 16.6
  Top Layer w0.254: U3.22 48.83,27.91 50.13,26.62 57.87,26.62 58.76,25.73 H1.1
FB: length 8
  Top Layer w0.254: R8.2 R7.1 7.88,28.95 8.09,29.16 9.23,29.16 9.68,29.61 U4.5
HIN: length 23.2
  Top Layer w0.254: R1.2 58.9,17.57 R2.2 ; Q4.3 46.17,17.21 ; 46.17,17.21 45.81,16.84 R30.1 R31.1 ; 46.17,17.21 48.29,17.21 R27.2 48.35,17.98 48.6,18.24 57.49,18.24 57.75,17.98 57.75,16.86 58.08,16.53 58.89,16.53
HIN_O: length 27.8
  Top Layer w0.254: R31.2 43.26,13.28 41.62,13.28 40.86,14.05 40.86,19.64 41.36,20.14 47.72,20.14 R28.1 48.6,21.02 v1(48.6,22.17) ; U3.10 44.67,29.91 v1(46.06,28.53)
  Bottom Layer w0.254: v1(48.6,22.17) 47.71,23.06 47.71,26.87 v1(46.06,28.53)
KEY: length 69.1
  Top Layer w0.254: U5.3 32.03,34.05 v1(32.09,33.99) ; R11.2 40.73,28.92 v1(40.73,28.78)
  Bottom Layer w0.254: KEY1.1 KEY1.2 47.26,58.81 47.26,43.56 44.16,40.46 32.6,40.46 32.09,39.95 v1(32.09,33.99) 32.09,29.41 32.73,28.78 v1(40.73,28.78)
LED0: length 15.5
  Top Layer w0.254: U3.23 49.1,28.41 50.31,27.2 v1(52.41,27.2)
  Bottom Layer w0.254: 54.71,17.96 54.95,18.2 54.95,21.79 52.41,24.33 v1(52.41,27.2)
LED1: length 10.6
  Top Layer w0.254: U3.24 49.36,28.91 50.38,27.89 52.55,27.89 53.24,27.2 v1(53.3,27.2)
  Bottom Layer w0.254: 54.72,24.01 53.62,24.01 53.3,24.33 v1(53.3,27.2)
LED2: length 9.5
  Top Layer w0.254: U3.25 49.62,29.41 50.64,28.4 53.3,28.4 v1(54.06,27.64)
  Bottom Layer w0.254: v1(54.06,27.64) 54.7,28.27 54.7,29.89 54.72,29.91
LED3: length 15.8
  Top Layer w0.254: U3.26 49.88,29.91 50.89,28.91 53.68,28.91 v1(54.06,28.53)
  Bottom Layer w0.254: v1(54.06,28.53) 53.18,29.41 53.18,35.64 53.43,35.89 54.5,35.89 54.57,35.96
NRST: length 16.6
  Top Layer w0.254: R17.2 38.26,27.51 ; 38.26,27.51 38.26,31.01 38.57,31.32 41.75,31.32 43.4,32.97 45.43,32.97 45.94,32.46 U3.4 ; 38.26,27.51 SW1.2
OIN: length 9.3
  Top Layer w0.254: C2.1 47.78,36.98 X1.1 47.66,36.91 46.83,36.91 46.57,36.65 46.57,33.61 46.94,33.24 U3.2
OOUT: length 6.5
  Top Layer w0.254: C3.2 45.47,35.19 45.48,35.18 45.48,33.55 46.44,32.6 U3.3
SWD: length 14.5
  Top Layer w0.254: H1.2 56.22,25.22 55.33,26.11 47.84,26.11 47.44,26.52 U3.21
TPS_EN: length 32.6
  Top Layer w0.254: U4.3 10.95,38.62 v1(10.63,38.94) 7.33,38.94 7.06,38.67 R3.1 R4.2 ; v1(30.76,40.65) 30.82,40.72 R10.1
  Bottom Layer w0.254: v1(10.63,38.94) 28.16,38.94 29.87,40.65 v1(30.76,40.65)
WAKE: length 9.6
  Top Layer w0.254: R9.1 31.97,37.56 31.97,38.81 32.22,39.07 33.49,39.07 34,39.57 34,40.7 R10.2 R21.2 36.55,38.44 R32.1
WAKE_UP: length 16.4
  Top Layer w0.254: U3.6 44.94,30.67 v1(45.17,30.43) ; R21.1 38.57,40.7 v1(38.57,39.19)
  Bottom Layer w0.254: v1(38.57,39.19) 38.57,38.18 39.71,37.03 39.71,31.83 41.11,30.43 v1(45.17,30.43)
$1N1231: length 20.2
  Top Layer w0.254: Q3.1 78.62,17.3 78.31,17.61 R2.1
$1N1235: length 20.3
  Top Layer w0.254: R1.1 61.82,15.44 arc(61.99,15.51) 62.05,15.67 62.05,16.74 arc(62.28,16.97) 62.51,16.74 62.51,15.67 arc(62.74,15.44) 62.97,15.67 62.97,16.74 arc(63.19,16.97) 63.42,16.74 63.42,15.67 arc(63.65,15.44) 63.88,15.67 63.88,16.74 arc(64.11,16.97) 64.34,16.74 64.34,15.67 arc(64.57,15.44) 64.8,15.67 64.8,16.74 arc(65.02,16.97) 65.25,16.74 65.25,15.67 arc(65.48,15.44) 65.71,15.67 65.71,16.74 arc(65.94,16.97) 66.17,16.74 66.17,15.67 arc(66.23,15.51) 66.4,15.44 67.39,15.44 67.41,15.46
$1N3158: length 2.4
  Top Layer w0.254: R9.2 33.98,35.19 U5.1
$1N3339: length 3.5
  Top Layer w0.254: R11.1 41.73,28.92 42,28.65 42.76,28.65 43.02,28.4 44,28.4 U3.13
$1N5444: length 5.5
  Top Layer w0.254: R18.1 53.18,39.45 ; R20.1 R19.2
$1N9210: length 32
  Top Layer w0.254: R28.2 48.28,19.19 Q4.1 42.95,19.19 42.75,18.99 R29.2 ; R32.2 36.54,29.16 36.28,28.91 35.27,28.91 34.89,28.53 34.89,25.73 35.4,25.22 40.22,25.22 41.75,23.7 42.25,23.7 42.76,23.19 v1(42.76,21.92)
  Bottom Layer w0.254: v1(42.76,21.92) 43.02,21.67 v1(43.02,19.13)
$1N9917: length 9.7
  Top Layer w0.254: v1(50.55,14.43) 50.53,14.45 R15.1
  Bottom Layer w0.254: v1(50.55,14.43) 52.33,16.21 55.84,16.21 56.73,17.09 56.73,17.86 56.64,17.95 56.67,17.98 LED12.2
$1N9919: length 25
  Top Layer w0.254: v1(52.61,14.43) 52.59,14.45 R14.1
  Bottom Layer w0.254: v1(52.61,14.43) 53.75,15.57 61.56,15.57 62.45,16.46 62.45,22.81 61.3,23.95 56.38,23.95 56.32,24.01
$1N9921: length 30.3
  Top Layer w0.254: R13.1 54.65,14.45 v1(54.67,14.43)
  Bottom Layer w0.254: v1(54.67,14.43) 55.31,15.06 61.81,15.06 62.95,16.21 62.95,29.16 62.21,29.91 56.32,29.91
$1N9923: length 35.1
  Top Layer w0.254: v1(56.73,14.43) 56.71,14.45 R12.1
  Bottom Layer w0.254: 56.17,35.95 56.24,36.02 61.81,36.02 63.46,34.37 63.46,15.95 61.94,14.43 v1(56.73,14.43)
$2N1364: length 2.8
  Top Layer w0.254: U4.1 16.11,37.04 arc(16.19,37.07) C5.1
$2N1375: length 8.8
  Top Layer w0.584: D1.1 19.52,31.5 U4.8 ; 16.09,32.97 16.09,35.02 arc(16.13,35.11) C5.2
$2N1674: length 8.2
  Top Layer w0.254: R5.2 7.06,32.19 7.2,32.33 8.09,32.33 8.34,32.59 8.34,36.78 8.6,37.03 9.67,37.03 U4.4
$2N1730: length 12.6
  Top Layer w0.254: R6.2 C9.2 9.61,28.14 10.95,29.48 U4.6
$2N1780: length 2.6
  Top Layer w0.254: C8.2 7.2,17.36 R6.1
$2N8883: length 1.8
  Top Layer w0.254: R22.2 14.82,11.5 LED5.1
$2N8964: length 1.8
  Top Layer w0.254: LED6.1 16.63,9.6 R23.2
$2N9032: length 1.8
  Top Layer w0.254: LED7.1 16.63,7.57 R24.2
$2N9110: length 2.5
  Top Layer w0.254: LED8.1 27.44,40.93 27.4,40.97

## Copper pours and planes (outline as drawn; the poured copper is in the pictures)
+15V on Top Layer: 12.15,17.98 25.11,17.98 25.11,12.52 12.15,12.52
AGND on Top Layer: 66.38,41.14 98.9,41.14 98.9,18.26 66.38,18.26
AGND on Bottom Layer: 66.38,41.14 98.9,41.14 98.9,18.26 66.38,18.26
GND on Top Layer: -7.44,68.52 63.46,68.52 64.96,67.02 64.96,39.92 63.16,38.12 63.16,1.02 59.96,-2.18 -5.74,-2.18 -7.44,-0.48
GND on Top Layer: 68.16,18.79 98.9,18.79 98.9,7.7 68.16,7.7
GND on Bottom Layer: 68.16,18.79 98.9,18.79 98.9,7.7 68.16,7.7
GND on Bottom Layer: -7.44,68.52 63.46,68.52 64.96,67.02 64.96,39.92 63.16,38.12 63.16,1.02 59.96,-2.18 -5.74,-2.18 -7.44,-0.48
VIN on Top Layer: 99.4,41.14 106.09,41.14 106.09,12.1 99.4,12.1
VIN on Bottom Layer: 99.4,41.14 106.09,41.14 106.09,12.1 99.4,12.1
$2N1375 on Top Layer: 14.31,33.99 19.14,33.99 19.14,28.27 14.31,28.27

## Text on the board
Bottom Silkscreen Layer: 输出 | 电池
Top Silkscreen Layer: 12.4V / 5V / 3.3V | 3.3V2 | 输出 | 电池
